# EAGLE board eclaire XL new (EAGLE 7.2.0), part 1 of 4
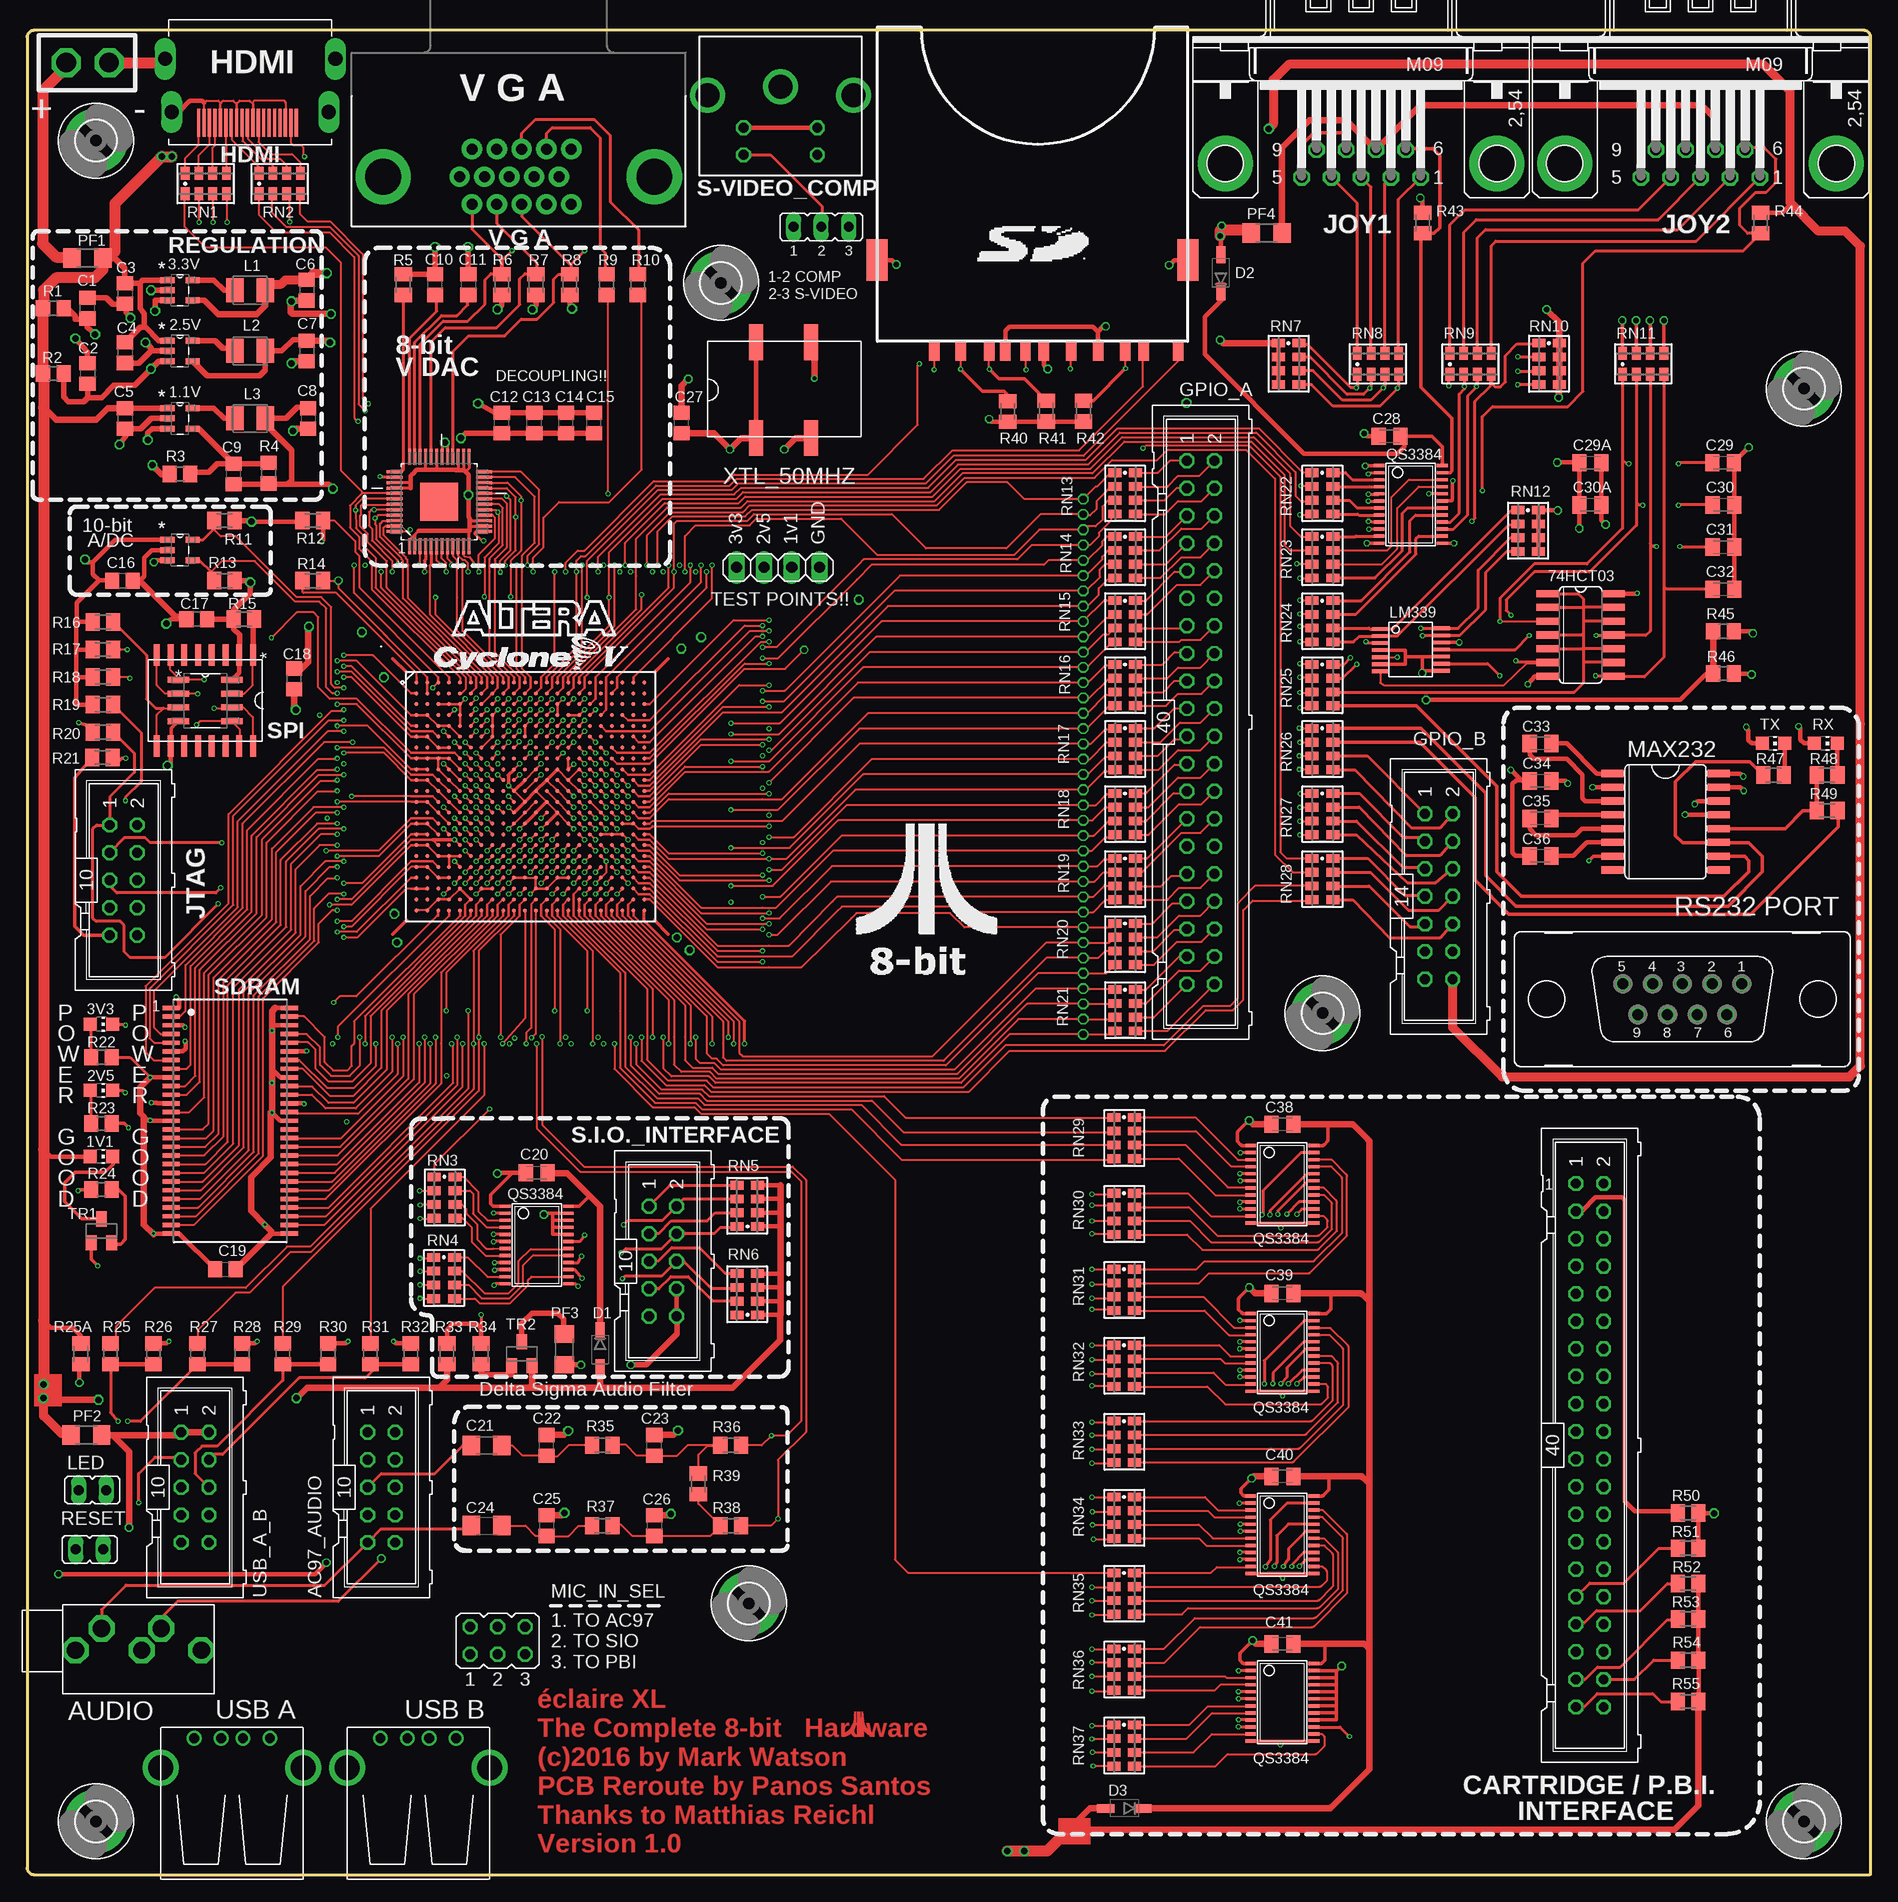
[diagram p17: board, top side]
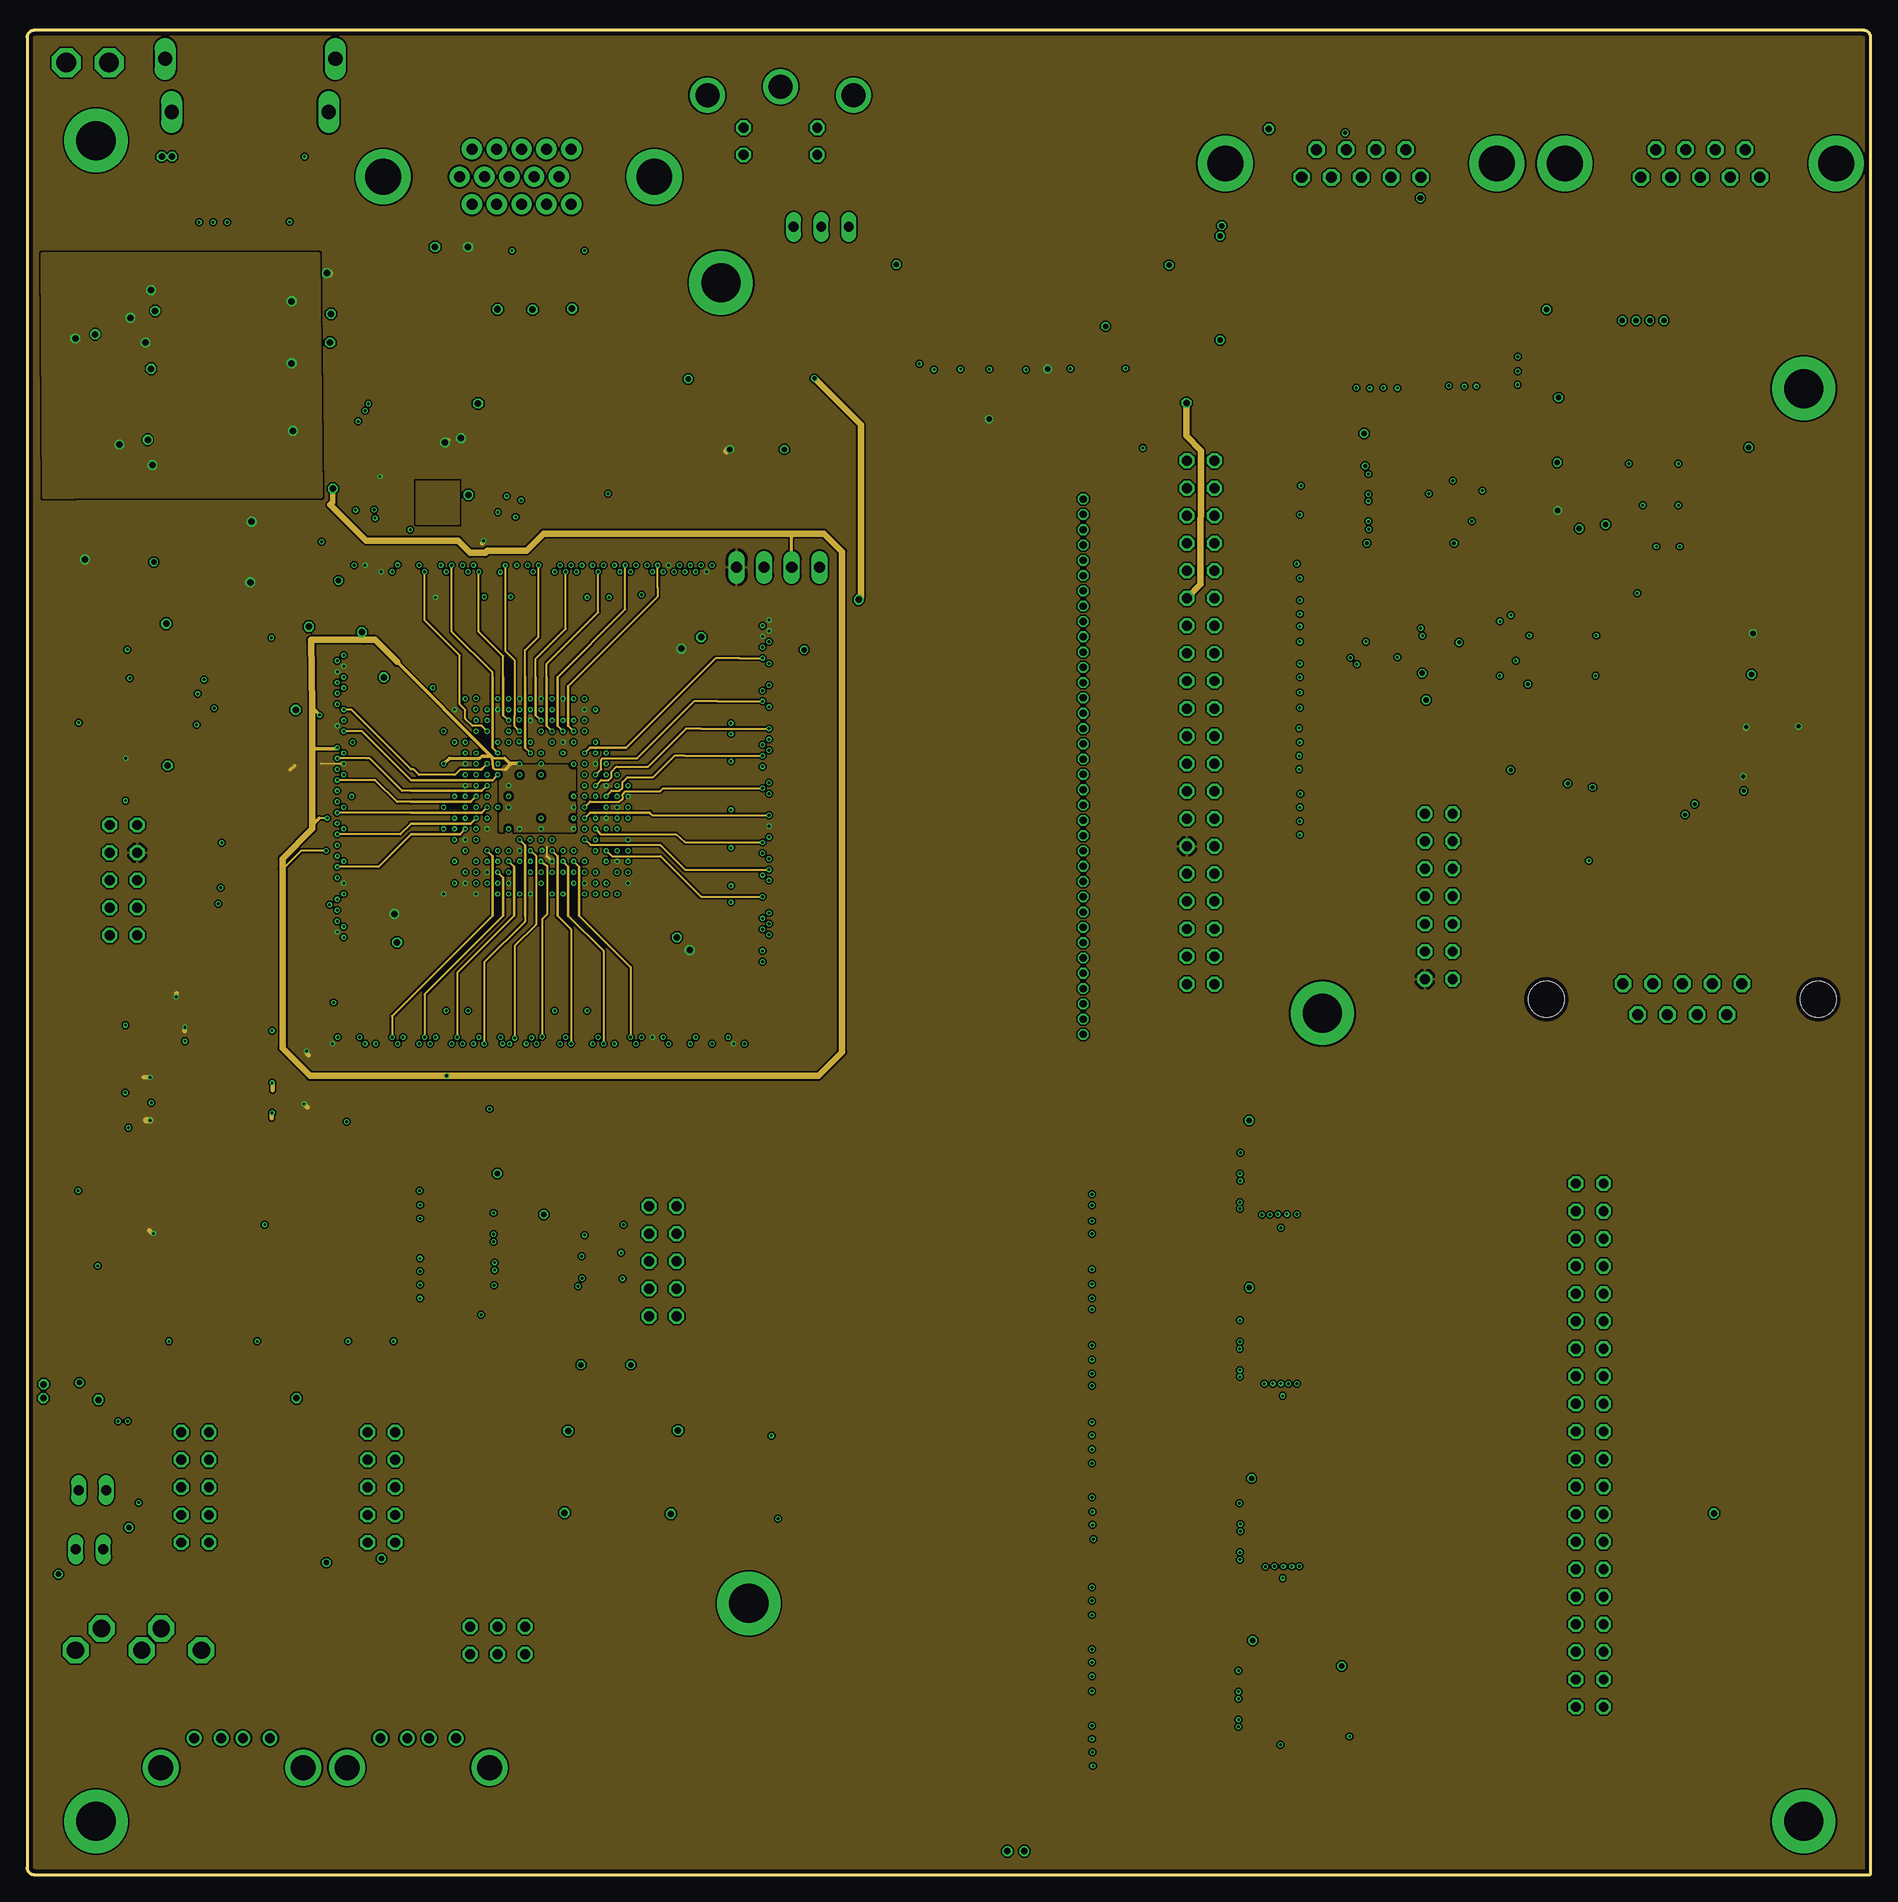
[diagram p18: board, inner layer Route2]
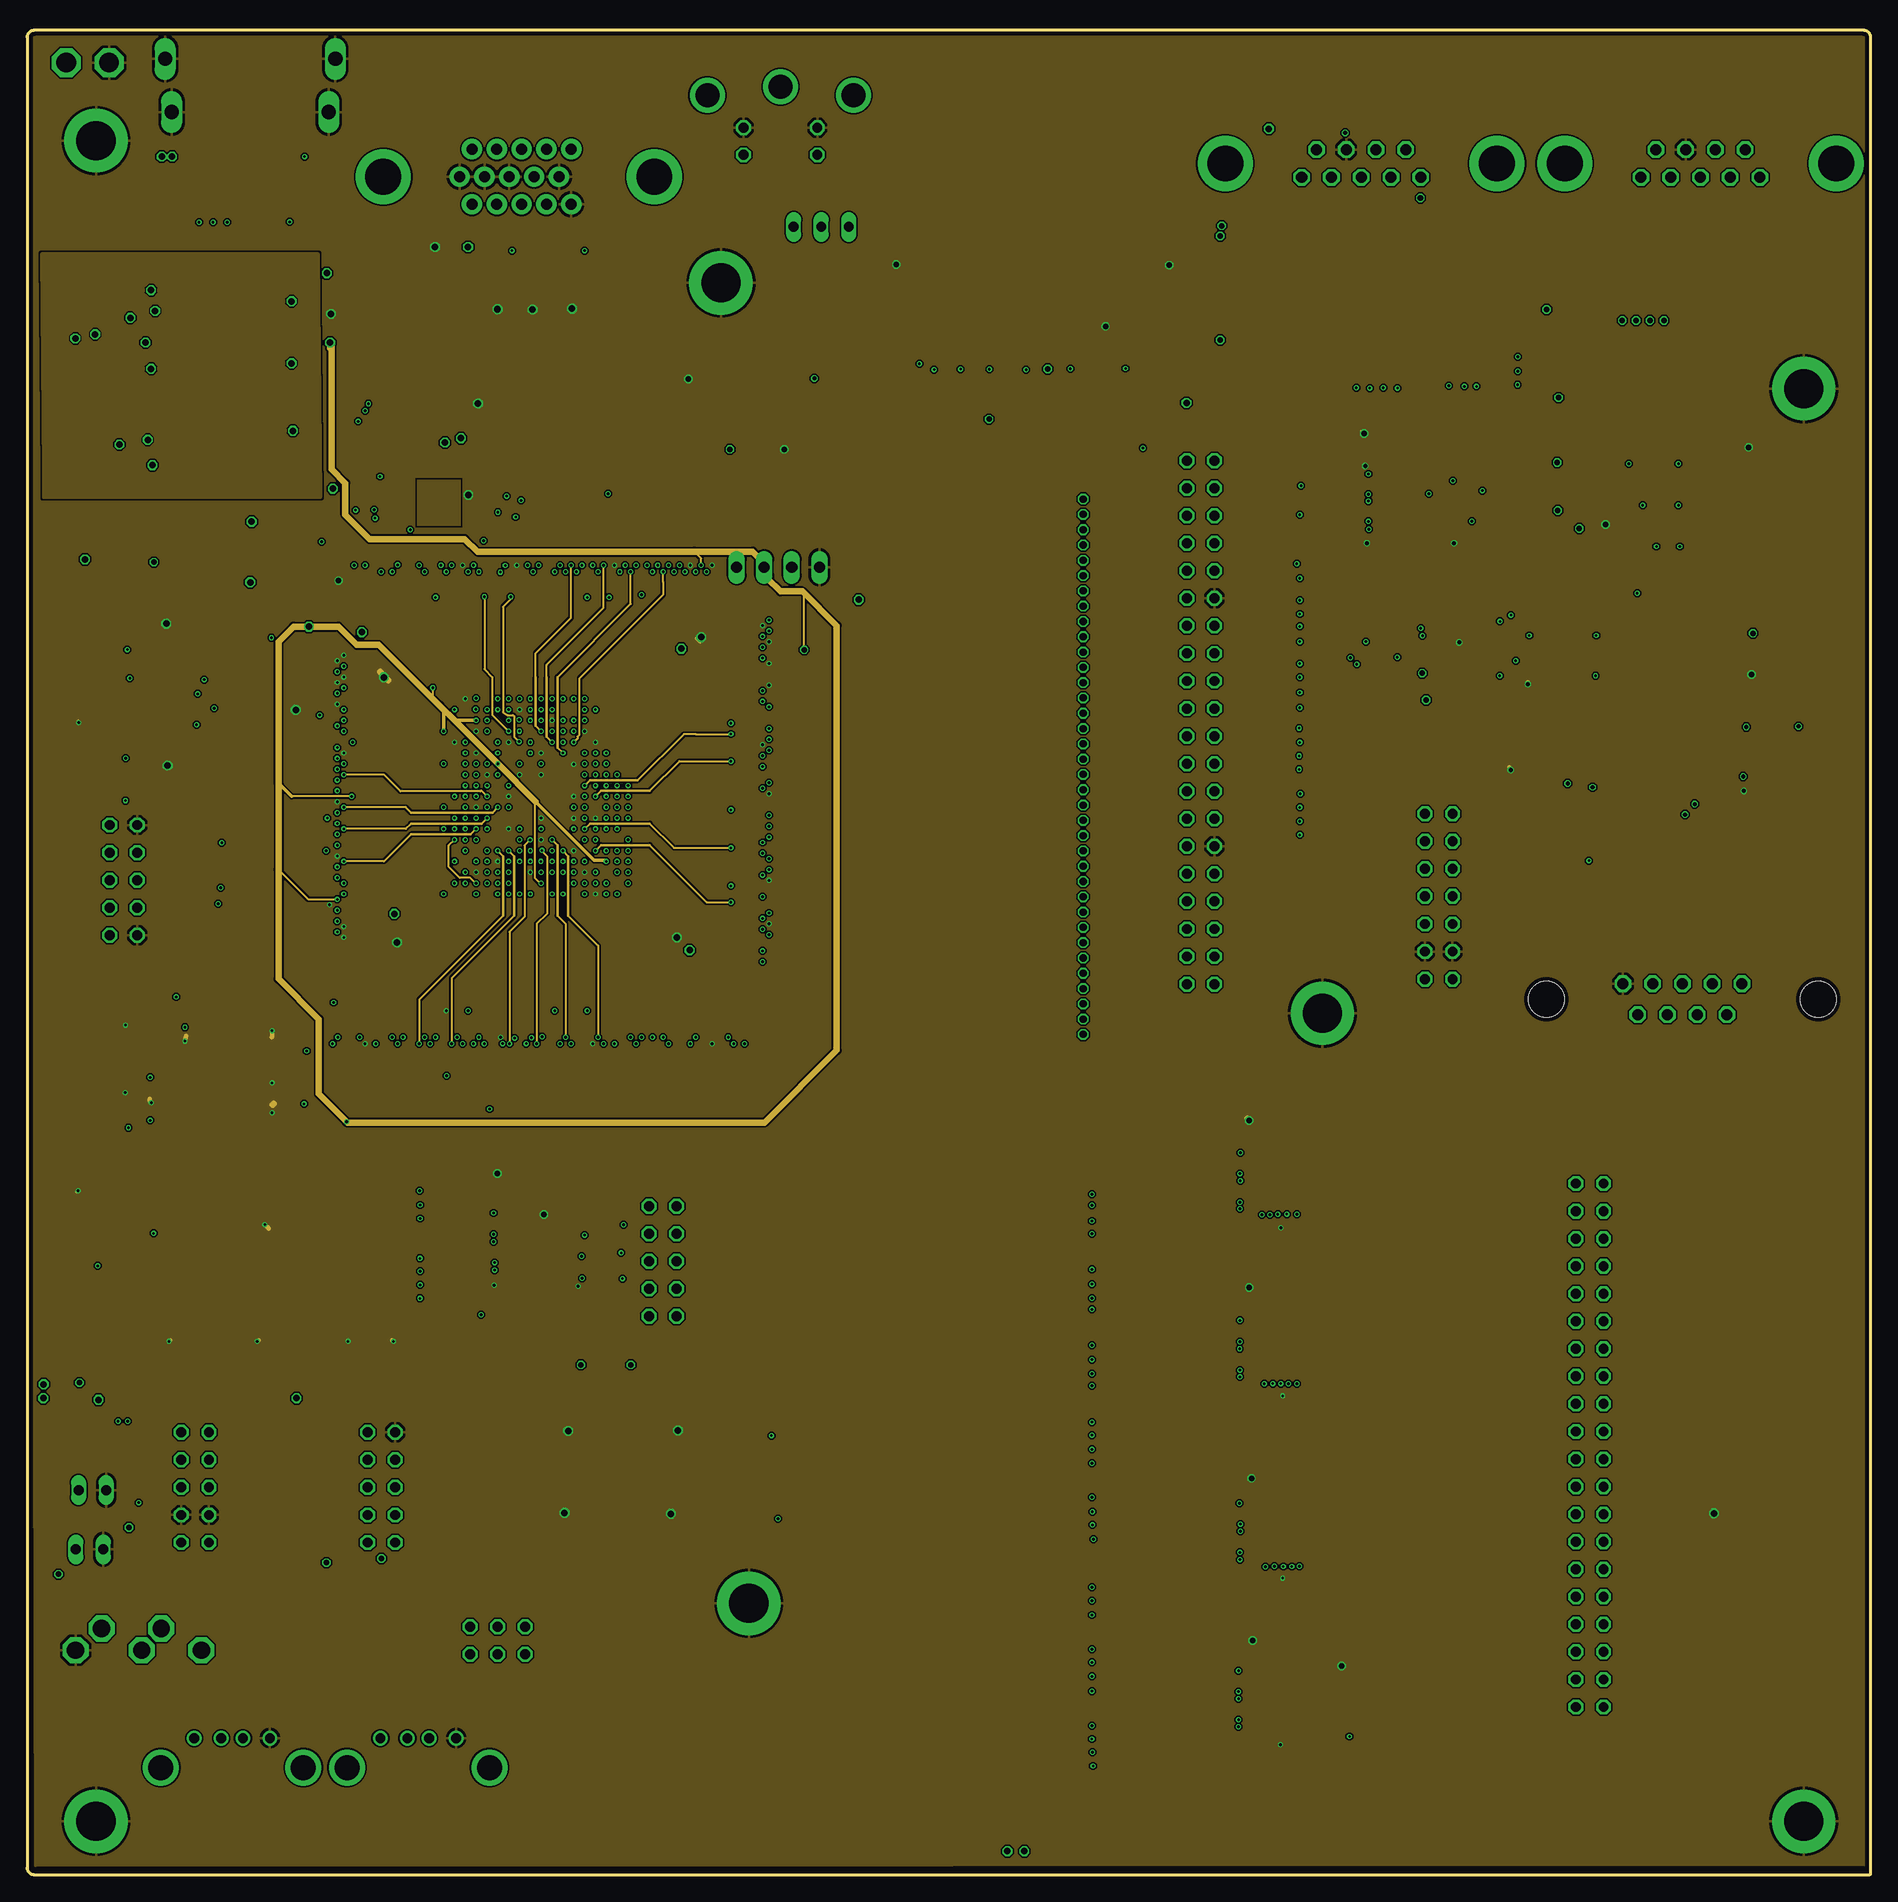
[diagram p19: board, inner layer Route15]
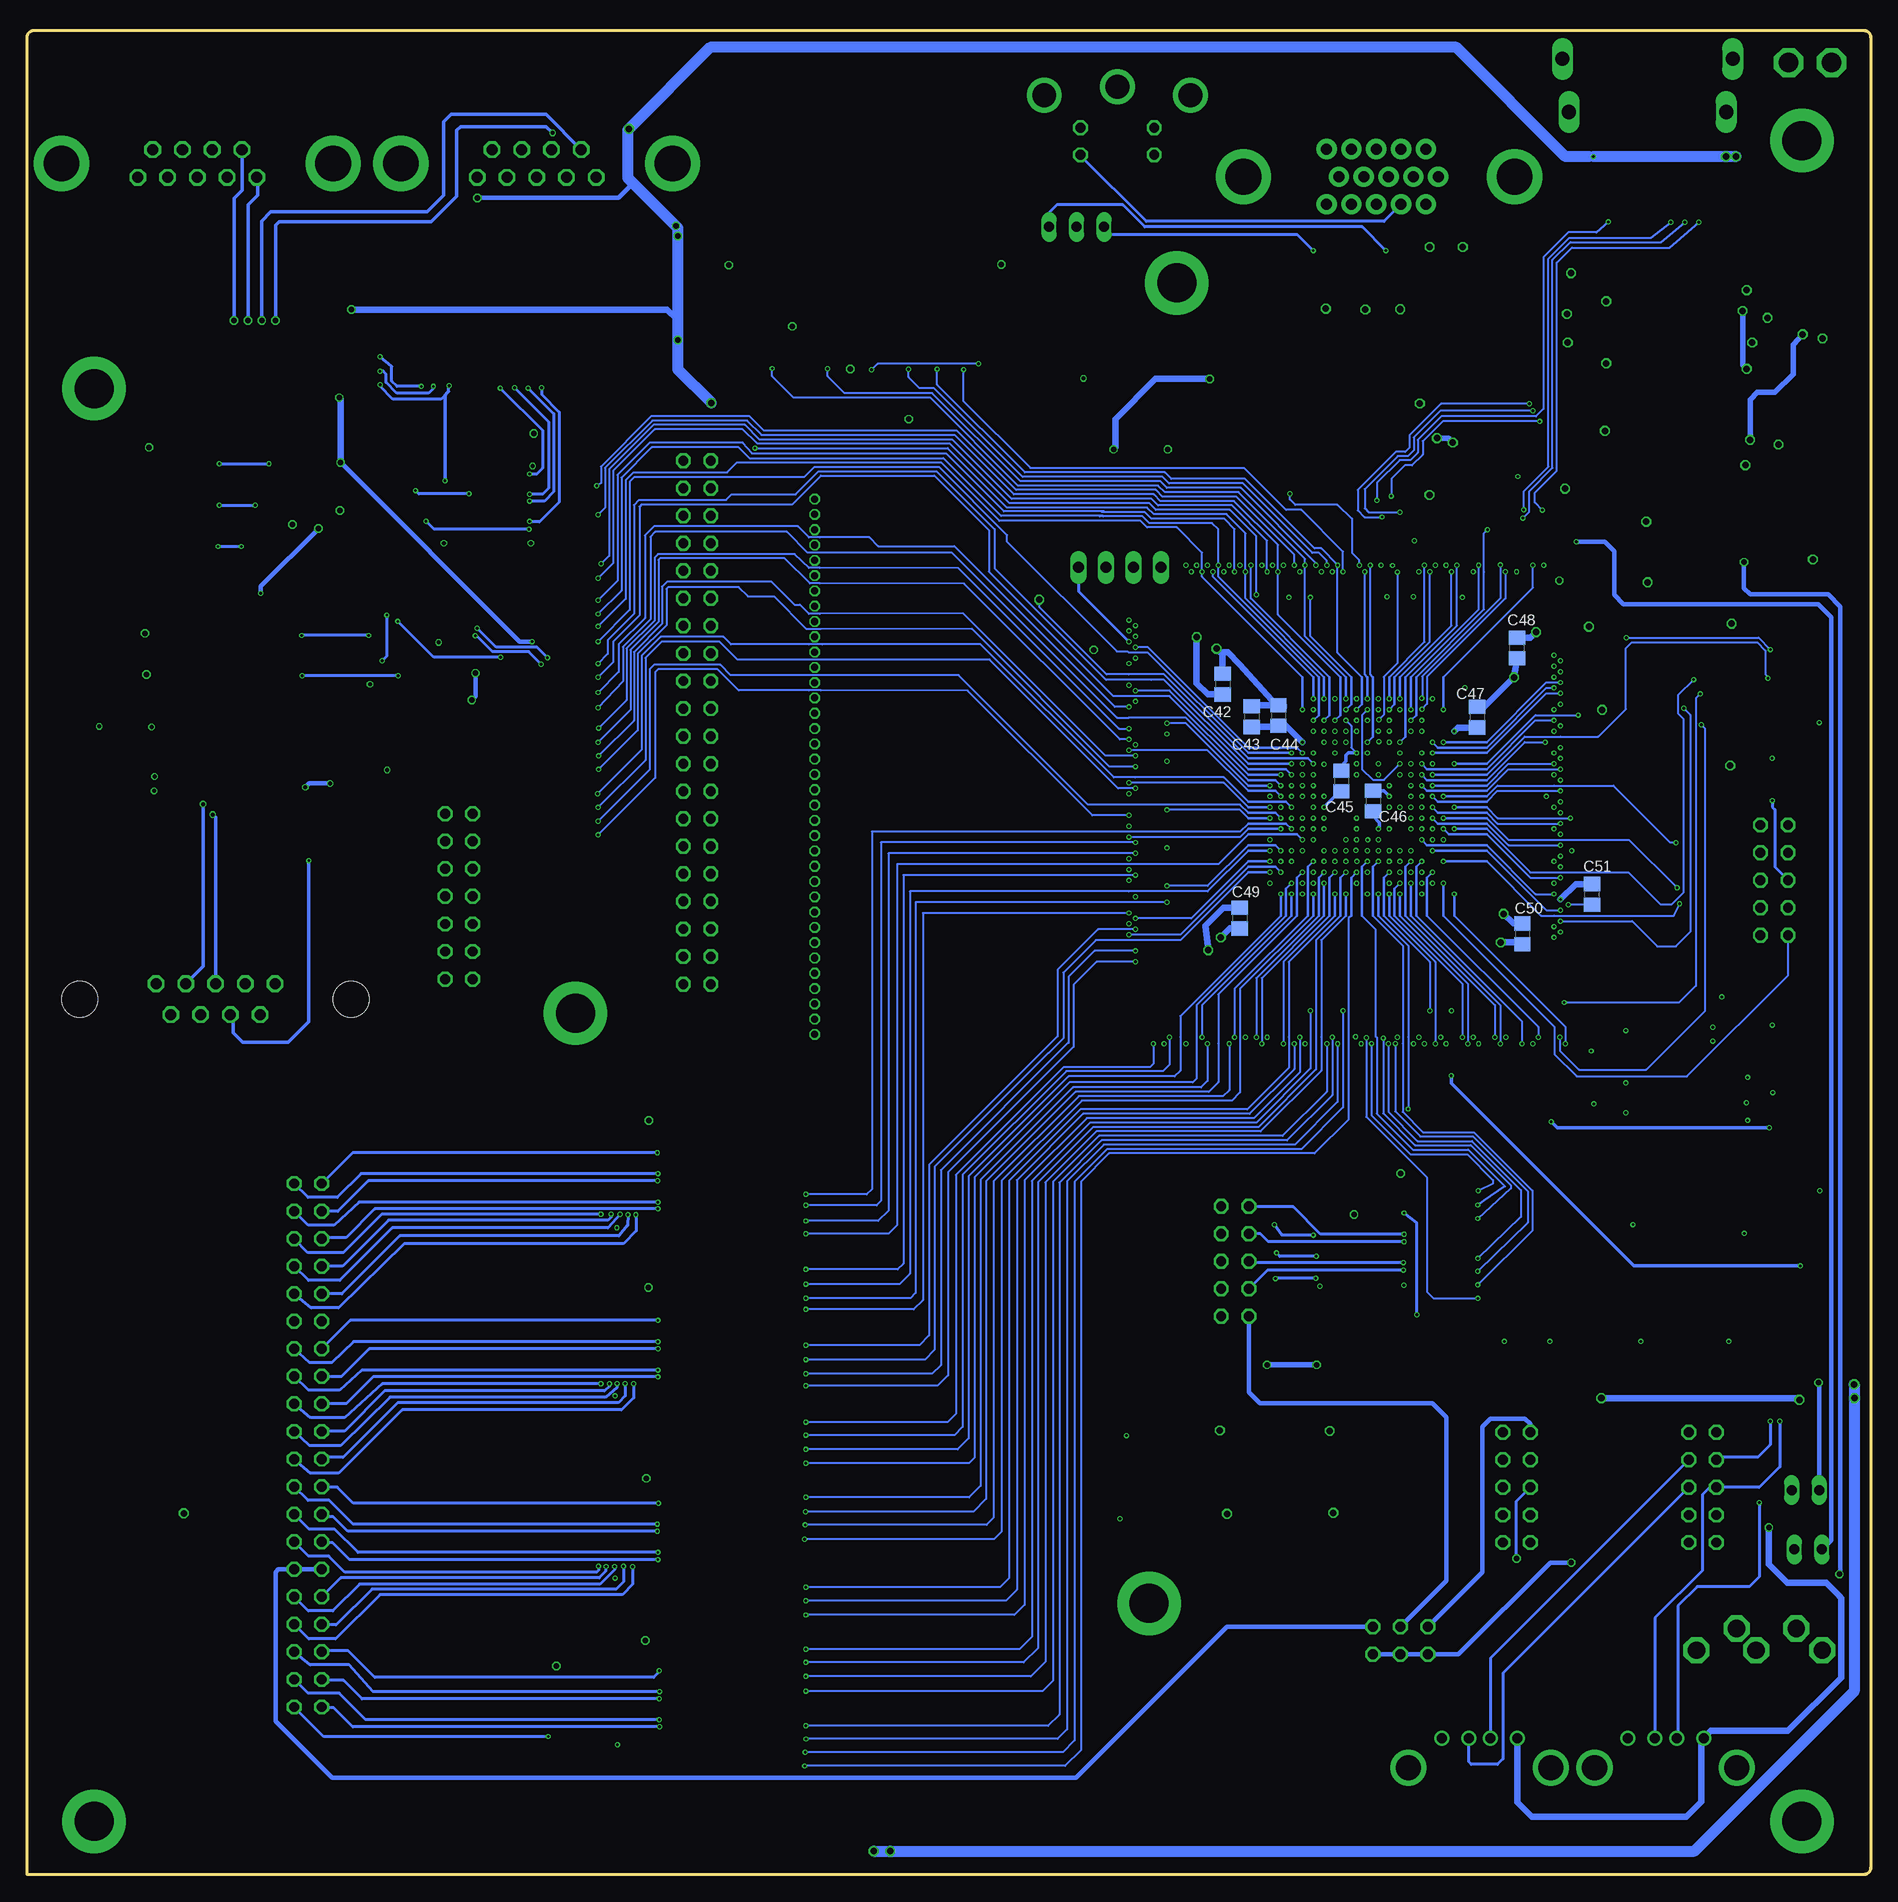
[diagram p20: board, bottom side, seen from below]

Size 170 x 170 mm. Coordinates in mm from the lower left corner, seen from the top.
Outline: 170,0 170,169.37 arc90 169.37,170 0.64,170 arc90 0,169.37 0,0.64 arc90 0.64,0 169.93,0
Copper layers (1*2*15*16): Top 0.035559375mm / dielectric 0.17018125mm / Route2 0.01778125mm / dielectric 47mil / Route15 0.01778125mm / dielectric 0.17018125mm / Bottom 0.035559375mm
Design rules "OSHPark-4layer *": minimum track width 5mil, minimum drill 10mil, track to track 5mil, track to pad 5mil, pad to pad 5mil, via to via 5mil, smd to smd 5mil, copper to edge 15mil, drill to drill 6mil, minimum pad ring 4mil, minimum via ring 4mil, stop-mask expansion 4mil, vias tented up to drill 10mil, thermal gap 10mil
Net classes: 3 N$8: width 0.508 mm

## Footprints (pad centres in the part's own frame; a part is rotated, then mirrored left to right if it is on the bottom)
SOT95P280X145-5N = smd 1.321 x 0.559: 1 -1.168,0.94; 2 -1.168,0; 3 -1.168,-0.94; 4 1.168,-0.94; 5 1.168,0.94
CHIP-LED0805 = smd 1.2 x 1.2: A 0,-1.05; C 0,1.05
1X04 = drill 1.016 long: 1 -3.81,0; 2 -1.27,0; 3 1.27,0; 4 3.81,0
SO14 = smd 0.66 x 2.032: 1 -3.81,-3.073; 2 -2.54,-3.073; 3 -1.27,-3.073; 4 0,-3.073; 5 1.27,-3.073; 6 2.54,-3.073; 7 3.81,-3.073; 8 3.81,3.073; 9 2.54,3.073; 10 1.27,3.073; 11 0,3.073; 12 -1.27,3.073; 13 -2.54,3.073; 14 -3.81,3.073
ML10 = drill 0.914 octagon: 1 -5.08,-1.27; 2 -5.08,1.27; 3 -2.54,-1.27; 4 -2.54,1.27; 5 0,-1.27; 6 0,1.27; 7 2.54,-1.27; 8 2.54,1.27; 9 5.08,-1.27; 10 5.08,1.27
C0805 = smd 1.3 x 1.5: 1 -0.95,0; 2 0.95,0
C0805K = smd 1.3 x 1.6: 1 -1,0; 2 1,0
C1206 = smd 1.6 x 1.8: 1 -1.4,0; 2 1.4,0
SOD123 = smd 1.6 x 0.8: 1 -1.7,0; 2 1.7,0
ML40 = drill 0.914 octagon: 1 -24.13,-1.27; 2 -24.13,1.27; 3 -21.59,-1.27; 4 -21.59,1.27; 5 -19.05,-1.27; 6 -19.05,1.27; 7 -16.51,-1.27; 8 -16.51,1.27; 9 -13.97,-1.27; 10 -13.97,1.27; 11 -11.43,-1.27; 12 -11.43,1.27; 13 -8.89,-1.27; 14 -8.89,1.27; 15 -6.35,-1.27; 16 -6.35,1.27; 17 -3.81,-1.27; 18 -3.81,1.27; 19 -1.27,-1.27; 20 -1.27,1.27; 21 1.27,-1.27; 22 1.27,1.27; 23 3.81,-1.27; 24 3.81,1.27; 25 6.35,-1.27; 26 6.35,1.27; 27 8.89,-1.27; 28 8.89,1.27; 29 11.43,-1.27; 30 11.43,1.27; 31 13.97,-1.27; 32 13.97,1.27; 33 16.51,-1.27; 34 16.51,1.27; 35 19.05,-1.27; 36 19.05,1.27; 37 21.59,-1.27; 38 21.59,1.27; 39 24.13,-1.27; 40 24.13,1.27
ML14 = drill 0.914 octagon: 1 -7.62,-1.27; 2 -7.62,1.27; 3 -5.08,-1.27; 4 -5.08,1.27; 5 -2.54,-1.27; 6 -2.54,1.27; 7 0,-1.27; 8 0,1.27; 9 2.54,-1.27; 10 2.54,1.27; 11 5.08,-1.27; 12 5.08,1.27; 13 7.62,-1.27; 14 7.62,1.27
3,6-PAD = drill 3.6 pad 5.842: B3,6 0,0
HDMI = smd 0.3 x 2.6: 1 4.75,4; 2 4.25,4; 3 3.75,4; 4 3.25,4; 5 2.75,4; 6 2.25,4; 7 1.75,4; 8 1.25,4; 9 0.75,4; 10 0.25,4; 11 -0.25,4; 12 -0.75,4; 13 -1.25,4; 14 -1.75,4; 15 -2.25,4; 16 -2.75,4; 17 -3.25,4; 18 -3.75,4; 19 -4.25,4 | drill 1.3 long: P$1 7.25,3; P$2 -7.25,3; P$3 -7.85,-1.9; P$4 7.85,-1.9
TSSOP24 = smd 0.305 x 0.991: 1 -3.575,-2.918; 2 -2.925,-2.918; 3 -2.275,-2.918; 4 -1.625,-2.918; 5 -0.975,-2.918; 6 -0.325,-2.918; 7 0.325,-2.918; 8 0.975,-2.918; 9 1.625,-2.918; 10 2.275,-2.918; 11 2.925,-2.918; 12 3.575,-2.918; 13 3.575,2.918; 14 2.925,2.918; 15 2.275,2.918; 16 1.625,2.918; 17 0.975,2.918; 18 0.325,2.918; 19 -0.325,2.918; 20 -0.975,2.918; 21 -1.625,2.918; 22 -2.275,2.918; 23 -2.925,2.918; 24 -3.575,2.918
AUDIO-JACK-CUI-353X = drill 1.6 pad 2.3 octagon: P$1 -1.9,4.6; P$2 0.1,2.2; P$3 0.1,-3.3; P$4 -1.9,-7 | drill 1.6 pad 2.4 octagon: P$5 -1.9,-1.5
M09HP = drill 1.016 octagon: 1 -5.486,1.27; 2 -2.743,1.27; 3 0,1.27; 4 2.743,1.27; 5 5.486,1.27; 6 -4.115,-1.27; 7 -1.372,-1.27; 8 1.372,-1.27; 9 4.115,-1.27 | drill 3.302 pad 5.08: G1 -12.522,0; G2 12.522,0
JP2 = drill 0.914 long: 1 -2.54,0; 2 0,0; 3 2.54,0
L3225M = smd 1.6 x 2.2: 1 -1.4,0; 2 1.4,0
TSSOP-14 = smd 1.6 x 0.35: 1 -2.8,1.9; 2 -2.8,1.25; 3 -2.8,0.6; 4 -2.8,-0.05; 5 -2.8,-0.7; 6 -2.8,-1.35; 7 -2.8,-2; 8 2.8,-1.95; 9 2.8,-1.3; 10 2.8,-0.65; 11 2.8,0; 12 2.8,0.65; 13 2.8,1.3; 14 2.8,1.95
SO16L = smd 0.66 x 2.032: 1 -4.445,-4.902; 2 -3.175,-4.902; 3 -1.905,-4.902; 4 -0.635,-4.902; 5 0.635,-4.902; 6 1.905,-4.902; 7 3.175,-4.902; 8 4.445,-4.902; 9 4.445,4.902; 10 3.175,4.902; 11 1.905,4.902; 12 0.635,4.902; 13 -0.635,4.902; 14 -1.905,4.902; 15 -3.175,4.902; 16 -4.445,4.902
JP3Q = drill 0.914 octagon: 1 -2.54,-1.27; 2 -2.54,1.27; 3 0,-1.27; 4 0,1.27; 5 2.54,-1.27; 6 2.54,1.27
R1206 = smd 1.6 x 1.803: 1 -1.422,0; 2 1.422,0
R0805 = smd 1.3 x 1.5: 1 -0.95,0; 2 0.95,0
M0805 = smd 1.3 x 1.6: 1 -0.95,0; 2 0.95,0
JP1 = drill 0.914 long: 1 0,-1.27; 2 0,1.27
743-8 = smd 0.8 x 1.2: 1 -1.905,-0.953; 2 -0.635,-0.953; 3 0.635,-0.953; 4 1.905,-0.953; 5 1.905,0.953; 6 0.635,0.953; 7 -0.635,0.953; 8 -1.905,0.953
MDIN04SS = drill 0.9 octagon: 1 3.4,8.5; 2 -3.4,8.5; 3 3.4,11; 4 -3.4,11 | drill 2.2: P$1 -6.74,5.5; P$2 0,4.71; P$3 6.74,5.5
SDSOCKET = smd 0.965 x 1.93: 1 7.7,-0.8; 2 10.3,-0.8; 3 11.8,-0.8; 3A 13.65,-0.8; 4 15.35,-0.8; 5 17.85,-0.8; 6 20.35,-0.8; 7 22.85,-0.8; 8 24.55,-0.8; 8A 27.75,-0.8; 9 5.25,-0.8 | smd 1.93 x 3.81: 10 -0.038,7.5; 11 28.638,7.5
TSOP54 = smd 0.4 x 1.6: 1 -10.4,-5.45; 2 -9.6,-5.45; 3 -8.8,-5.45; 4 -8,-5.45; 5 -7.2,-5.45; 6 -6.4,-5.45; 7 -5.6,-5.45; 8 -4.8,-5.45; 9 -4,-5.45; 10 -3.2,-5.45; 11 -2.4,-5.45; 12 -1.6,-5.45; 13 -0.8,-5.45; 14 0,-5.45; 15 0.8,-5.45; 16 1.6,-5.45; 17 2.4,-5.45; 18 3.2,-5.45; 19 4,-5.45; 20 4.8,-5.45; 21 5.6,-5.45; 22 6.4,-5.45; 23 7.2,-5.45; 24 8,-5.45; 25 8.8,-5.45; 26 9.6,-5.45; 27 10.4,-5.45; 28 10.4,5.45; 29 9.6,5.45; 30 8.8,5.45; 31 8,5.45; 32 7.2,5.45; 33 6.4,5.45; 34 5.6,5.45; 35 4.8,5.45; 36 4,5.45; 37 3.2,5.45; 38 2.4,5.45; 39 1.6,5.45; 40 0.8,5.45; 41 0,5.45; 42 -0.8,5.45; 43 -1.6,5.45; 44 -2.4,5.45; 45 -3.2,5.45; 46 -4,5.45; 47 -4.8,5.45; 48 -5.6,5.45; 49 -6.4,5.45; 50 -7.2,5.45; 51 -8,5.45; 52 -8.8,5.45; 53 -9.6,5.45; 54 -10.4,5.45
EPCS_BOTH = smd 1.981 x 0.559: 1 -2.464,1.905; 2 -2.464,0.635; 3 -2.464,-0.635; 4 -2.464,-1.905; 5 2.464,-1.905; 6 2.464,-0.635; 7 2.464,0.635; 8 2.464,1.905 | smd 0.559 x 1.981: L$1 4.41,4.21; L$2 3.14,4.21; L$3 1.87,4.21; L$4 0.6,4.21; L$5 -0.67,4.21; L$6 -1.94,4.21; L$7 -3.21,4.21; L$8 -4.48,4.21; L$9 -4.48,-4.21; L$10 -3.21,-4.21; L$11 -1.94,-4.21; L$12 -0.67,-4.21; L$13 0.6,-4.21; L$14 1.87,-4.21; L$15 3.14,-4.21; L$16 4.41,-4.21
SOT23-BEC = smd 1 x 1.4: B -0.95,-1.1; C 0,1.1; E 0.95,-1.1
CYCLONEVF484V2 = smd 0.38 x 0.38: A1 -10.5,10.5; A2 -9.5,10.5; A3 -8.5,10.5; A4 -7.5,10.5; A5 -6.5,10.5; A6 -5.5,10.5; A7 -4.5,10.5; A8 -3.5,10.5; A9 -2.5,10.5; A10 -1.5,10.5; A11 -0.5,10.5; A12 0.5,10.5; A13 1.5,10.5; A14 2.5,10.5; A15 3.5,10.5; A16 4.5,10.5; A17 5.5,10.5; A18 6.5,10.5; A19 7.5,10.5; A20 8.5,10.5; A21 9.5,10.5; A22 10.5,10.5; AA1 -10.5,-9.5; AA2 -9.5,-9.5; AA3 -8.5,-9.5; AA4 -7.5,-9.5; AA5 -6.5,-9.5; AA6 -5.5,-9.5; AA7 -4.5,-9.5; AA8 -3.5,-9.5; AA9 -2.5,-9.5; AA10 -1.5,-9.5; AA11 -0.5,-9.5; AA12 0.5,-9.5; AA13 1.5,-9.5; AA14 2.5,-9.5; AA15 3.5,-9.5; AA16 4.5,-9.5; AA17 5.5,-9.5; AA18 6.5,-9.5; AA19 7.5,-9.5; AA20 8.5,-9.5; AA21 9.5,-9.5; AA22 10.5,-9.5; AB1 -10.5,-10.5; AB2 -9.5,-10.5; AB3 -8.5,-10.5; AB4 -7.5,-10.5; AB5 -6.5,-10.5; AB6 -5.5,-10.5; AB7 -4.5,-10.5; AB8 -3.5,-10.5; AB9 -2.5,-10.5; AB10 -1.5,-10.5; AB11 -0.5,-10.5; AB12 0.5,-10.5; AB13 1.5,-10.5; AB14 2.5,-10.5; AB15 3.5,-10.5; AB16 4.5,-10.5; AB17 5.5,-10.5; AB18 6.5,-10.5; AB19 7.5,-10.5; AB20 8.5,-10.5; AB21 9.5,-10.5; AB22 10.5,-10.5; B1 -10.5,9.5; B2 -9.5,9.5; B3 -8.5,9.5; B4 -7.5,9.5; B5 -6.5,9.5; B6 -5.5,9.5; B7 -4.5,9.5; B8 -3.5,9.5; B9 -2.5,9.5; B10 -1.5,9.5; B11 -0.5,9.5; B12 0.5,9.5; B13 1.5,9.5; B14 2.5,9.5; B15 3.5,9.5; B16 4.5,9.5; B17 5.5,9.5; B18 6.5,9.5; B19 7.5,9.5; B20 8.5,9.5; B21 9.5,9.5; B22 10.5,9.5; C1 -10.5,8.5; C2 -9.5,8.5; C3 -8.5,8.5; C4 -7.5,8.5; C5 -6.5,8.5; C6 -5.5,8.5; C7 -4.5,8.5; C8 -3.5,8.5; C9 -2.5,8.5; C10 -1.5,8.5; C11 -0.5,8.5; C12 0.5,8.5; C13 1.5,8.5; C14 2.5,8.5; C15 3.5,8.5; C16 4.5,8.5; C17 5.5,8.5; C18 6.5,8.5; C19 7.5,8.5; C20 8.5,8.5; C21 9.5,8.5; C22 10.5,8.5; D1 -10.5,7.5; D2 -9.5,7.5; D3 -8.5,7.5; D4 -7.5,7.5; D5 -6.5,7.5; D6 -5.5,7.5; D7 -4.5,7.5; D8 -3.5,7.5; D9 -2.5,7.5; D10 -1.5,7.5; D11 -0.5,7.5; D12 0.5,7.5; D13 1.5,7.5; D14 2.5,7.5; D15 3.5,7.5; D16 4.5,7.5; D17 5.5,7.5; D18 6.5,7.5; D19 7.5,7.5; D20 8.5,7.5; D21 9.5,7.5; D22 10.5,7.5; E1 -10.5,6.5; E2 -9.5,6.5; E3 -8.5,6.5; E4 -7.5,6.5; E5 -6.5,6.5; E6 -5.5,6.5; E7 -4.5,6.5; E8 -3.5,6.5; E9 -2.5,6.5; E10 -1.5,6.5; E11 -0.5,6.5; E12 0.5,6.5; E13 1.5,6.5; E14 2.5,6.5; E15 3.5,6.5; E16 4.5,6.5; E17 5.5,6.5; E18 6.5,6.5; E19 7.5,6.5; E20 8.5,6.5; E21 9.5,6.5; E22 10.5,6.5; F1 -10.5,5.5; F2 -9.5,5.5; F3 -8.5,5.5; F4 -7.5,5.5; F5 -6.5,5.5; F6 -5.5,5.5; F7 -4.5,5.5; F8 -3.5,5.5; F9 -2.5,5.5; F10 -1.5,5.5; F11 -0.5,5.5; F12 0.5,5.5; F13 1.5,5.5; F14 2.5,5.5; F15 3.5,5.5; F16 4.5,5.5; F17 5.5,5.5; F18 6.5,5.5; F19 7.5,5.5; F20 8.5,5.5; F21 9.5,5.5; F22 10.5,5.5; G1 -10.5,4.5; G2 -9.5,4.5; G3 -8.5,4.5; G4 -7.5,4.5; G5 -6.5,4.5; G6 -5.5,4.5; G7 -4.5,4.5; G8 -3.5,4.5; G9 -2.5,4.5; G10 -1.5,4.5; G11 -0.5,4.5; G12 0.5,4.5; G13 1.5,4.5; G14 2.5,4.5; G15 3.5,4.5; G16 4.5,4.5; G17 5.5,4.5; G18 6.5,4.5; G19 7.5,4.5; G20 8.5,4.5; G21 9.5,4.5; G22 10.5,4.5; H1 -10.5,3.5; H2 -9.5,3.5; H3 -8.5,3.5; H4 -7.5,3.5; H5 -6.5,3.5; H6 -5.5,3.5; H7 -4.5,3.5; H8 -3.5,3.5; H9 -2.5,3.5; H10 -1.5,3.5; H11 -0.5,3.5; H12 0.5,3.5; H13 1.5,3.5; H14 2.5,3.5; H15 3.5,3.5; H16 4.5,3.5; H17 5.5,3.5; H18 6.5,3.5; H19 7.5,3.5; H20 8.5,3.5; H21 9.5,3.5; H22 10.5,3.5; J1 -10.5,2.5; J2 -9.5,2.5; J3 -8.5,2.5; J4 -7.5,2.5; J5 -6.5,2.5; J6 -5.5,2.5; J7 -4.5,2.5; J8 -3.5,2.5; J9 -2.5,2.5; J10 -1.5,2.5; J11 -0.5,2.5; J12 0.5,2.5; J13 1.5,2.5; J14 2.5,2.5; J15 3.5,2.5; J16 4.5,2.5; J17 5.5,2.5; J18 6.5,2.5; J19 7.5,2.5; J20 8.5,2.5; J21 9.5,2.5; J22 10.5,2.5; K1 -10.5,1.5; K2 -9.5,1.5; K3 -8.5,1.5; K4 -7.5,1.5; K5 -6.5,1.5; K6 -5.5,1.5; K7 -4.5,1.5; K8 -3.5,1.5; K9 -2.5,1.5; K10 -1.5,1.5; K11 -0.5,1.5; K12 0.5,1.5; K13 1.5,1.5; K14 2.5,1.5; K15 3.5,1.5; K16 4.5,1.5; K17 5.5,1.5; K18 6.5,1.5; K19 7.5,1.5; K20 8.5,1.5; K21 9.5,1.5; K22 10.5,1.5; L1 -10.5,0.5; L2 -9.5,0.5; L3 -8.5,0.5; L4 -7.5,0.5; L5 -6.5,0.5; L6 -5.5,0.5; L7 -4.5,0.5; L8 -3.5,0.5; L9 -2.5,0.5; L10 -1.5,0.5; L11 -0.5,0.5; L12 0.5,0.5; L13 1.5,0.5; L14 2.5,0.5; L15 3.5,0.5; L16 4.5,0.5; L17 5.5,0.5; L18 6.5,0.5; L19 7.5,0.5; L20 8.5,0.5; L21 9.5,0.5; L22 10.5,0.5; M1 -10.5,-0.5; M2 -9.5,-0.5; M3 -8.5,-0.5; M4 -7.5,-0.5; M5 -6.5,-0.5; M6 -5.5,-0.5; M7 -4.5,-0.5; M8 -3.5,-0.5; M9 -2.5,-0.5; M10 -1.5,-0.5; M11 -0.5,-0.5; M12 0.5,-0.5; M13 1.5,-0.5; M14 2.5,-0.5; M15 3.5,-0.5; M16 4.5,-0.5; M17 5.5,-0.5; M18 6.5,-0.5; M19 7.5,-0.5; M20 8.5,-0.5; M21 9.5,-0.5; M22 10.5,-0.5; N1 -10.5,-1.5; N2 -9.5,-1.5; N3 -8.5,-1.5; N4 -7.5,-1.5; N5 -6.5,-1.5; N6 -5.5,-1.5; N7 -4.5,-1.5; N8 -3.5,-1.5; N9 -2.5,-1.5; N10 -1.5,-1.5; N11 -0.5,-1.5; N12 0.5,-1.5; N13 1.5,-1.5; N14 2.5,-1.5; N15 3.5,-1.5; N16 4.5,-1.5; N17 5.5,-1.5; N18 6.5,-1.5; N19 7.5,-1.5; N20 8.5,-1.5; N21 9.5,-1.5; N22 10.5,-1.5; P1 -10.5,-2.5; P2 -9.5,-2.5; P3 -8.5,-2.5; P4 -7.5,-2.5; P5 -6.5,-2.5; P6 -5.5,-2.5; P7 -4.5,-2.5; P8 -3.5,-2.5; P9 -2.5,-2.5; P10 -1.5,-2.5; P11 -0.5,-2.5; P12 0.5,-2.5; P13 1.5,-2.5; P14 2.5,-2.5; P15 3.5,-2.5; P16 4.5,-2.5; P17 5.5,-2.5; P18 6.5,-2.5; P19 7.5,-2.5; P20 8.5,-2.5; P21 9.5,-2.5; P22 10.5,-2.5; R1 -10.5,-3.5; R2 -9.5,-3.5; R3 -8.5,-3.5; R4 -7.5,-3.5; R5 -6.5,-3.5; R6 -5.5,-3.5; R7 -4.5,-3.5; R8 -3.5,-3.5; R9 -2.5,-3.5; R10 -1.5,-3.5; R11 -0.5,-3.5; R12 0.5,-3.5; R13 1.5,-3.5; R14 2.5,-3.5; R15 3.5,-3.5; R16 4.5,-3.5; R17 5.5,-3.5; R18 6.5,-3.5; R19 7.5,-3.5; R20 8.5,-3.5; R21 9.5,-3.5; R22 10.5,-3.5; T1 -10.5,-4.5; T2 -9.5,-4.5; T3 -8.5,-4.5; T4 -7.5,-4.5; T5 -6.5,-4.5; T6 -5.5,-4.5; T7 -4.5,-4.5; T8 -3.5,-4.5; T9 -2.5,-4.5; T10 -1.5,-4.5; T11 -0.5,-4.5; T12 0.5,-4.5; T13 1.5,-4.5; T14 2.5,-4.5; T15 3.5,-4.5; T16 4.5,-4.5; T17 5.5,-4.5; T18 6.5,-4.5; T19 7.5,-4.5; T20 8.5,-4.5; T21 9.5,-4.5; T22 10.5,-4.5; U1 -10.5,-5.5; U2 -9.5,-5.5; U3 -8.5,-5.5; U4 -7.5,-5.5; U5 -6.5,-5.5; U6 -5.5,-5.5; U7 -4.5,-5.5; U8 -3.5,-5.5; U9 -2.5,-5.5; U10 -1.5,-5.5; U11 -0.5,-5.5; U12 0.5,-5.5; U13 1.5,-5.5; U14 2.5,-5.5; U15 3.5,-5.5; U16 4.5,-5.5; U17 5.5,-5.5; U18 6.5,-5.5; U19 7.5,-5.5; U20 8.5,-5.5; U21 9.5,-5.5; U22 10.5,-5.5; V1 -10.5,-6.5; V2 -9.5,-6.5; V3 -8.5,-6.5; V4 -7.5,-6.5; V5 -6.5,-6.5; V6 -5.5,-6.5; V7 -4.5,-6.5; V8 -3.5,-6.5; V9 -2.5,-6.5; V10 -1.5,-6.5; V11 -0.5,-6.5; V12 0.5,-6.5; V13 1.5,-6.5; V14 2.5,-6.5; V15 3.5,-6.5; V16 4.5,-6.5; V17 5.5,-6.5; V18 6.5,-6.5; V19 7.5,-6.5; V20 8.5,-6.5; V21 9.5,-6.5; V22 10.5,-6.5; W1 -10.5,-7.5; W2 -9.5,-7.5; W3 -8.5,-7.5; W4 -7.5,-7.5; W5 -6.5,-7.5; W6 -5.5,-7.5; W7 -4.5,-7.5; W8 -3.5,-7.5; W9 -2.5,-7.5; W10 -1.5,-7.5; W11 -0.5,-7.5; W12 0.5,-7.5; W13 1.5,-7.5; W14 2.5,-7.5; W15 3.5,-7.5; W16 4.5,-7.5; W17 5.5,-7.5; W18 6.5,-7.5; W19 7.5,-7.5; W20 8.5,-7.5; W21 9.5,-7.5; W22 10.5,-7.5; Y1 -10.5,-8.5; Y2 -9.5,-8.5; Y3 -8.5,-8.5; Y4 -7.5,-8.5; Y5 -6.5,-8.5; Y6 -5.5,-8.5; Y7 -4.5,-8.5; Y8 -3.5,-8.5; Y9 -2.5,-8.5; Y10 -1.5,-8.5; Y11 -0.5,-8.5; Y12 0.5,-8.5; Y13 1.5,-8.5; Y14 2.5,-8.5; Y15 3.5,-8.5; Y16 4.5,-8.5; Y17 5.5,-8.5; Y18 6.5,-8.5; Y19 7.5,-8.5; Y20 8.5,-8.5; Y21 9.5,-8.5; Y22 10.5,-8.5
HDR_141_36 = drill 0.65 octagon: P$1 -25.38,0; P$2 -23.97,0; P$3 -22.56,0; P$4 -21.15,0; P$5 -19.74,0; P$6 -18.33,0; P$7 -16.92,0; P$8 -15.51,0; P$9 -14.1,0; P$10 -12.69,0; P$11 -11.28,0; P$12 -9.87,0; P$13 -8.46,0; P$14 -7.05,0; P$15 -5.64,0; P$16 -4.23,0; P$17 -2.82,0; P$18 -1.41,0; P$19 0,0; P$20 1.41,0; P$21 2.82,0; P$22 4.23,0; P$23 5.64,0; P$24 7.05,0; P$25 8.46,0; P$26 9.87,0; P$27 11.28,0; P$28 12.69,0; P$29 14.1,0; P$30 15.51,0; P$31 16.92,0; P$32 18.33,0; P$33 19.74,0; P$34 21.15,0; P$35 22.56,0; P$36 23.97,0
MOLEX_PS = drill 1.8 octagon: + 0,0; - 3.96,0
DB15 = drill 1.016 pad 1.88: 1 -4.32,-7.62; 2 -2.03,-7.62; 3 0.26,-7.62; 4 2.55,-7.62; 5 4.84,-7.62; 6 -5.46,-5.08; 7 -3.17,-5.08; 8 -0.88,-5.08; 9 1.41,-5.08; 10 3.7,-5.08; 11 -4.32,-2.54; 12 -2.03,-2.54; 13 0.26,-2.54; 14 2.55,-2.54; 15 4.84,-2.54 | drill 3.302 pad 5.08: G1 -12.5,-5.08; G2 12.5,-5.08
QFP50P900X900X120-49N = smd 1.473 x 0.279: 1 -4.115,2.743; 2 -4.115,2.261; 3 -4.115,1.753; 4 -4.115,1.245; 5 -4.115,0.762; 6 -4.115,0.254; 7 -4.115,-0.254; 8 -4.115,-0.762; 9 -4.115,-1.245; 10 -4.115,-1.753; 11 -4.115,-2.261; 12 -4.115,-2.743; 25 4.115,-2.743; 26 4.115,-2.261; 27 4.115,-1.753; 28 4.115,-1.245; 29 4.115,-0.762; 30 4.115,-0.254; 31 4.115,0.254; 32 4.115,0.762; 33 4.115,1.245; 34 4.115,1.753; 35 4.115,2.261; 36 4.115,2.743 | smd 0.279 x 1.473: 13 -2.743,-4.115; 14 -2.261,-4.115; 15 -1.753,-4.115; 16 -1.245,-4.115; 17 -0.762,-4.115; 18 -0.254,-4.115; 19 0.254,-4.115; 20 0.762,-4.115; 21 1.245,-4.115; 22 1.753,-4.115; 23 2.261,-4.115; 24 2.743,-4.115; 37 2.743,4.115; 38 2.261,4.115; 39 1.753,4.115; 40 1.245,4.115; 41 0.762,4.115; 42 0.254,4.115; 43 -0.254,4.115; 44 -0.762,4.115; 45 -1.245,4.115; 46 -1.753,4.115; 47 -2.261,4.115; 48 -2.743,4.115 | smd 3.505 x 3.505: 49 0,0
USB-A-H = drill 0.914: D+ 2.718,-1.003; D- 2.718,1.003; GND 2.718,-3.493; VBUS 2.718,3.493 | drill 2.311: P$5 0,-6.566; P$6 0,6.566
F09V = drill 1.016 octagon: 1 5.486,1.422; 2 2.743,1.422; 3 0,1.422; 4 -2.743,1.422; 5 -5.486,1.422; 6 4.115,-1.422; 7 1.372,-1.422; 8 -1.372,-1.422; 9 -4.115,-1.422 | hole 3.302: -12.522,0; 12.522,0
SG-636 = smd 1.3 x 3.3: P$1 -2.54,-5.03; P$2 2.54,-5.03; P$3 2.54,3.8; P$4 -2.54,3.8

## Placement (x,y rotation side)
1.1V  U3  [SOT95P280X145-5N]  14.1,134.24 0 top
1V1  White  [CHIP-LED0805]  6.86,66.19 270 top
2.5V  U2  [SOT95P280X145-5N]  14.1,140.46 0 top
2V5  Green  [CHIP-LED0805]  6.86,72.29 270 top
3.3/2.5/1.1/GND  J2  [1X04]  69.24,120.5 0 top
3.3V  U1  [SOT95P280X145-5N]  14.1,146.05 0 top
3V3  Red  [CHIP-LED0805]  6.86,78.38 270 top
74HCT03  U12  [SO14]  143.26,114.27 270 top
AC97_AUDIO  [ML10]  32.66,35.69 270 top
ADC  U4  [SOT95P280X145-5N]  14.1,122.1 0 top
C1  10uF  [C0805]  5.56,144.4 90 top
C2  10uF  [C0805]  5.56,138.38 270 top
C3  10uF  [C0805]  9.02,145.76 270 top
C4  10uF  [C0805]  9.02,140.29 270 top
C5  10uF  [C0805]  9.02,134.24 270 top
C6  22uF  [C0805]  25.78,146.05 270 top
C7  22uF  [C0805]  25.78,140.46 270 top
C8  22uF  [C0805]  25.91,134.24 270 top
C9  15pF  [C0805]  19.05,129.11 90 top
C10  0.1uF  [C0805]  37.63,146.56 90 top
C11  0.1uF  [C0805]  40.68,146.56 270 top
C12  0.1uF  [C0805]  43.77,133.81 90 top
C13  0.01uF  [C0805]  46.77,133.81 90 top
C14  0.1uF  [C0805]  49.7,133.81 90 top
C15  10uF  [C0805]  52.28,133.81 90 top
C16  0.1uF  [C0805]  8.79,119.28 0 top
C17  0.1uF  [C0805]  15.65,115.72 180 top
C18  2.2uF  [C0805]  24.63,110.23 90 top
C19  0.1uF  [C0805]  18.28,55.8 0 top
C20  0.1uF  [C0805K]  46.99,64.69 180 top
C21  100uF  [C1206]  42.37,39.57 0 top
C22  10nF  [C0805]  47.9,39.57 90 top
C23  10nF  [C0805]  57.84,39.57 90 top
C24  100uF  [C1206]  42.37,32.16 0 top
C25  10nF  [C0805]  47.9,32.16 270 top
C26  10nF  [C0805]  57.84,32.16 270 top
C27  0.1uF  [C0805]  60.36,133.81 90 top
C28  0.1uF  [C0805K]  125.63,132.59 0 top
C29  0.047uF  [C0805K]  156.39,130.15 0 top
C29A  0.1uF  [C0805K]  144.15,130.15 0 top
C30  0.047uF  [C0805K]  156.41,126.26 0 top
C30A  0.1uF  [C0805K]  144.15,126.26 0 top
C31  0.047uF  [C0805K]  156.41,122.38 0 top
C32  0.047uF  [C0805K]  156.41,118.49 0 top
C33  1UF  [C0805K]  139.55,104.27 180 top
C34  1UF  [C0805K]  139.55,100.81 180 top
C35  1UF  [C0805K]  139.55,97.36 180 top
C36  1UF  [C0805K]  139.55,93.9 180 top
C38  0.1uF  [C0805K]  115.75,69.16 180 top
C39  0.1uF  [C0805K]  115.75,53.57 180 top
C40  0.1uF  [C0805K]  115.75,36.7 180 top
C41  0.1uF  [C0805K]  115.75,21.26 180 top
C42  0.01uF  [C0805]  59.76,109.74 270 bottom
C43  0.022uF  [C0805]  57.08,106.74 270 bottom
C44  10uF  [C0805]  54.62,106.84 270 bottom
C45  0.047uF  [C0805]  48.8,100.8 270 bottom
C46  0.047uF  [C0805]  45.88,98.97 270 bottom
C47  0.022uF  [C0805]  36.31,106.69 270 bottom
C48  10uF  [C0805]  32.6,113.07 90 bottom
C49  0.01uF  [C0805]  58.19,88.16 270 bottom
C50  0.022uF  [C0805]  32.12,86.73 270 bottom
C51  0.0047uF  [C0805]  25.69,90.36 90 bottom
D1  1N4148  [SOD123]  52.83,48.41 270 top
D2  1N4148  [SOD123]  110.08,147.62 90 top
D3  1N4148  [SOD123]  101.17,6.1 180 top
GPIO_A  [ML40]  108.22,106.22 270 top
GPIO_B  [ML14]  130.18,90.17 270 top
H1  MOUNT-PAD-ROUND3.6  [3,6-PAD]  6.35,159.84 0 top
H2  MOUNT-PAD-ROUND3.6  [3,6-PAD]  163.83,136.98 0 top
H3  MOUNT-PAD-ROUND3.6  [3,6-PAD]  6.35,4.9 0 top
H4  MOUNT-PAD-ROUND3.6  [3,6-PAD]  163.83,4.9 0 top
H5  MOUNT-PAD-ROUND3.6  [3,6-PAD]  63.98,146.73 0 top
H6  MOUNT-PAD-ROUND3.6  [3,6-PAD]  66.55,24.99 0 top
H7  MOUNT-PAD-ROUND3.6  [3,6-PAD]  119.44,79.4 0 top
HDMI  HDMI  [HDMI]  20.57,165.48 180 top
IC1  U14  [TSSOP24]  115.75,63.63 270 top
IC2  U15  [TSSOP24]  115.75,48.13 270 top
IC3  U16  [TSSOP24]  115.75,31.32 270 top
IC4  U17  [TSSOP24]  115.75,15.88 270 top
IC5  U10  [TSSOP24]  127.58,126.31 270 top
J3  AUDIO-JACK2CUI  [AUDIO-JACK-CUI-353X]  9.07,22.58 90 top
JOY1  JOYSTICK1  [M09HP]  123.01,157.73 180 top
JOY2  JOYSTICK2  [M09HP]  154.31,157.73 180 top
JP2  [JP2]  73.23,151.89 0 top
JTAG  [ML10]  8.9,91.67 270 top
L1  1uH  [L3225M]  20.57,146.05 0 top
L2  1uH  [L3225M]  20.57,140.46 0 top
L3  1uH  [L3225M]  20.57,134.24 0 top
LM339  U11  [TSSOP-14]  127.58,112.93 0 top
MAX232  U13  [SO16L]  151.08,97.05 270 top
MIC_IN_SEL  J1  [JP3Q]  43.38,21.56 0 top
P.B.I._INTERFACE  [ML40]  144.09,39.57 270 top
PF1  1A  [R1206]  5.57,149.02 0 top
PF2  500mA  [R1206]  5.46,40.51 0 top
PF3  500mA  [R1206]  49.53,48.41 90 top
PF4  500mA  [R1206]  114.3,151.33 0 top
QS3384  U9  [TSSOP24]  46.99,58.04 270 top
R1  1k  [R0805]  2.41,144.4 0 top
R2  4k7  [R0805]  2.41,138.38 0 top
R3  200  [R0805]  14.1,129.11 0 top
R4  240  [R0805]  22.28,129.18 270 top
R5  348  [M0805]  34.69,146.56 270 top
R6  75  [M0805]  43.77,146.56 90 top
R7  75  [M0805]  46.92,146.56 90 top
R8  75  [M0805]  50.05,146.56 90 top
R9  100  [R0805]  53.44,146.56 90 top
R10  100  [R0805]  56.31,146.56 90 top
R11  2k  [M0805]  18.19,124.82 180 top
R12  10k  [M0805]  26.34,124.82 180 top
R13  2k  [M0805]  18.19,119.28 0 top
R14  2K 1%  [M0805]  26.34,119.28 0 top
R15  4.7k  [M0805]  19.99,115.73 0 top
R16  4.7k  [M0805]  6.99,115.47 0 top
R17  10k  [M0805]  6.99,112.93 180 top
R18  10k  [M0805]  6.99,110.39 180 top
R19  1k-10k  [M0805]  6.99,107.85 180 top
R20  1k  [M0805]  6.99,105.31 180 top
R21  1k-10k  [M0805]  6.96,102.97 0 top
R22  82  [R0805]  6.86,75.34 0 top
R23  56  [R0805]  6.86,69.24 0 top
R24  56  [R0805]  6.86,63.14 180 top
R25  22  [R0805]  7.69,48.01 270 top
R25A  560  [M0805]  4.95,48.01 270 top
R26  15k  [R0805]  11.65,48.01 90 top
R27  22  [R0805]  15.71,48.01 270 top
R28  15k  [R0805]  19.83,48.01 90 top
R29  22  [R0805]  23.59,48.01 270 top
R30  15k  [R0805]  27.75,48.01 90 top
R31  22  [R0805]  31.66,48.01 270 top
R32  15k  [R0805]  35.4,48.01 90 top
R33  2k7  [M0805]  38.71,48.01 90 top
R34  2k7  [M0805]  41.86,48.01 270 top
R35  560  [M0805]  53.04,39.57 0 top
R36  560  [M0805]  64.87,39.57 0 top
R37  560  [M0805]  53.04,32.16 0 top
R38  560  [M0805]  64.87,32.16 0 top
R39  1k  [M0805]  61.9,36.02 90 top
R40  47K  [M0805]  90.42,134.87 270 top
R41  47K  [M0805]  93.98,134.9 270 top
R42  47K  [M0805]  97.41,134.9 270 top
R43  4.7k  [M0805]  128.68,152.25 90 top
R44  4.7k  [M0805]  159.84,152.25 90 top
R45  1.2K  [R0805]  156.41,114.6 0 top
R46  2.1K  [R0805]  156.41,110.72 180 top
R47  330  [M0805]  161.04,101.35 180 top
R48  330  [M0805]  165.99,101.35 180 top
R49  330  [M0805]  165.99,98.09 180 top
R50  10k  [M0805]  153.16,33.32 180 top
R51  10k  [M0805]  153.16,30.07 180 top
R52  4k7  [M0805]  153.16,26.82 180 top
R53  4k7  [M0805]  153.16,23.57 180 top
R54  4k7  [M0805]  153.16,19.76 180 top
R55  4k7  [M0805]  153.16,15.95 180 top
RESET  RESET  [JP1]  5.77,29.97 90 top
RESET_LED  RESET  [JP1]  6.02,35.43 270 top
RN1  270  [743-8]  16.48,155.88 0 top
RN2  270  [743-8]  23.3,155.88 0 top
RN3  100  [743-8]  38.51,62.41 270 top
RN4  100  [743-8]  38.46,54.99 270 top
RN5  4K7  [743-8]  66.4,61.65 90 top
RN6  4K7  [743-8]  66.4,53.49 90 top
RN7  4K7  [743-8]  116.33,139.27 270 top
RN8  220  [743-8]  124.56,139.27 0 top
RN9  220  [743-8]  133.1,139.27 0 top
RN10  4K7  [743-8]  140.34,139.27 270 top
RN11  1K  [743-8]  149.02,139.27 0 top
RN12  4K7  [743-8]  138.4,123.88 270 top
RN13  100  [743-8]  101.24,127.32 270 top
RN14  100  [743-8]  101.24,121.43 270 top
RN15  100  [743-8]  101.24,115.54 270 top
RN16  100  [743-8]  101.24,109.64 270 top
RN17  100  [743-8]  101.24,103.75 270 top
RN18  100  [743-8]  101.24,97.76 270 top
RN19  100  [743-8]  101.24,91.76 270 top
RN20  100  [743-8]  101.24,85.77 270 top
RN21  100  [743-8]  101.24,79.67 270 top
RN22  100  [743-8]  119.44,127.32 270 top
RN23  100  [743-8]  119.44,121.43 270 top
RN24  100  [743-8]  119.44,115.54 270 top
RN25  100  [743-8]  119.44,109.64 270 top
RN26  100  [743-8]  119.44,103.75 270 top
RN27  100  [743-8]  119.44,97.76 270 top
RN28  100  [743-8]  119.44,91.76 270 top
RN29  100  [743-8]  101.17,67.89 270 top
RN30  100  [743-8]  101.17,60.89 270 top
RN31  100  [743-8]  101.17,53.89 270 top
RN32  100  [743-8]  101.17,46.89 270 top
RN33  100  [743-8]  101.17,39.89 270 top
RN34  100  [743-8]  101.17,32.89 270 top
RN35  100  [743-8]  101.17,25.89 270 top
RN36  100  [743-8]  101.17,18.89 270 top
RN37  100  [743-8]  101.17,11.89 270 top
RX  [CHIP-LED0805]  165.86,104.27 270 top
S-VIDEO_COMP  [MDIN04SS]  69.47,169.53 180 top
S.I.O._INTERFACE  [ML10]  58.62,56.54 270 top
SD  [SDSOCKET]  78.41,141.33 0 top
SDRAM  U8  [TSOP54]  18.73,69.49 270 top
SPI  U6  [EPCS_BOTH]  16.43,108.23 0 top
TR1  BC817-16LT1SMD  [SOT23-BEC]  6.86,59.33 0 top
TR2  MOT  [SOT23-BEC]  45.62,48.01 0 top
TX  [CHIP-LED0805]  161.04,104.27 270 top
U$1  U7  [CYCLONEVF484V2]  46.41,99.39 0 top
U$5  HDR_SMALL_36_DEV_LALIGNED  [HDR_141_36]  97.38,101.41 270 top
U$6  MOLEX_PS  [MOLEX_PS]  3.61,167.03 0 top
USB_A_B  [ML10]  15.49,35.69 270 top
VGA  DB15  [DB15]  45.34,161.59 0 top
VIDEODACSA  U5  [QFP50P900X900X120-49N]  38.01,126.57 90 top
X1  [USB-A-H]  18.9,9.86 90 top
X2  [F09V]  152.63,80.7 0 top
X3  [USB-A-H]  36.07,9.86 90 top
XTL_50MHZ  50MHz  [SG-636]  69.75,137.46 0 top

## Tracks (layer width: path | path; a pad name or v marks a point on that pad's centre or on a via)
1V1  (via drill 0.25, 0.25 pad 0.46, 0.6)
  Top 0.2: 35.41,97.39 32.41,94.39 v27.58,94.39 | 35.41,101.39 32.91,103.89 v28.61,103.89
  Top 0.203: U$1.K15 U$1.J16
  Top 0.25: U$1.P13 v47.41,96.39 | U$1.N4 v38.41,98.39 | U$1.K13 U$1.L14 U$1.M15 v50.41,98.39 | v38.41,102.39 U$1.J4 U$1.K5 | U$1.K11 U$1.J12 v47.41,102.39 | U$1.P3 37.41,97.39 35.41,97.39 | U$1.N10 v44.41,98.39 | v45.41,96.39 U$1.P11 U$1.N12 | 35.41,101.39 37.41,101.39 U$1.K3 U$1.L4 | v50.41,96.39 U$1.P15 U$1.N14 U$1.M13 U$1.L12 | U$1.J14 U$1.K15 U$1.L16 v51.41,99.39 | U$1.J16 v51.41,101.39 | U$1.J10 v45.41,102.39 | v44.41,100.39 U$1.L10 U$1.M11
  Top 0.305: U$1.K11 U$1.L10 | U$1.J10 44.91,101.85 44.37,101.32 44.41,101.29 v44.41,100.39 44.37,100.36 | U$1.J14 U$1.K13 U$1.L12 U$1.M11 U$1.N10 | U$1.N14 U$1.P13 | U$1.P11 U$1.M13 | TR1.B 5.91,56.7 v6.5,56.11
  Top 0.508: C8.1 25.84,135.25 24.89,135.25 23.88,134.24 L3.2 21.97,133.73 24.38,131.32 24.38,128.52 24,128.14 | 24,128.14 22.86,128.14 | 22.86,128.14 22.37,128.14 R4.2 | C9.1 22.2,128.16 R4.2 | R4.2 22.77,128.23 22.86,128.14 | 24,128.14 27.81,128.14 v28.19,127.76
  Route2 0.203: v27.68,97.39 26.93,97.39 | 42.95,102.03 43.16,101.88 44.12,101.88 | v27.58,94.39 25.25,94.39 23.55,92.69
  Route2 0.229: 42.95,102.03 42.9,102.89 44.02,102.89
  Route2 0.254: 38.96,102.89 41.73,102.89 | 3.3/2.5/1.1/GND.3 70.51,123.27 70.87,123.62
  Route2 0.305: 34.11,111.78 42.67,103.17 | 42.67,103.17 42.9,103 42.9,102.89 | 44.58,102.44 44.63,102.44 | 44.63,102.44 45.36,102.44 v45.41,102.39 | 38.96,102.89 v38.41,102.39 | 26.93,97.39 26.29,96.75 | 26.29,103.76 28.48,103.76 v28.61,103.89 | 26.9,107.01 26.29,107.62 | 41.73,102.89 41.94,103.1 42.6,103.1 42.67,103.17 | 44.12,101.88 44.63,102.44 | 44.02,102.89 44.58,102.34
  Route2 0.508: v28.19,127.76 28.19,126.49 27.96,126.26
  Route2 0.61: 31.06,113.82 32.08,113.82 34.11,111.78 | 31.06,113.82 26.19,113.82 26.29,107.62 26.29,103.76 26.29,96.75 26.29,96.39 23.55,93.65 23.55,92.69 23.55,76.17 26.09,73.64 v38.68,73.64 72.97,73.64 75.16,75.82 75.16,121.94 73.48,123.62 70.87,123.62 47.62,123.62 46.05,122.05 42.44,122.05 42.24,121.84 40.87,121.84 39.75,122.96 31.27,122.96 27.96,126.26 | v30.86,114.53 30.86,114.02 31.06,113.82
  Bottom 0.2: 35.41,98.39 34.41,97.39 v27.68,97.39 | 35.41,102.39 30.91,106.89 v26.98,106.89
  Bottom 0.25: v38.41,98.39 35.41,98.39 | v38.41,102.39 35.41,102.39
  Bottom 0.305: C45.2 48.95,99.85 v50.41,98.39 | C46.2 45.88,97.55 45.29,96.95 45.29,96.51 v45.41,96.39 | v6.5,56.11 21.84,56.11 38.68,72.95 v38.68,73.64
  Bottom 0.61: v30.86,114.53 31.37,114.02 C48.2
  pour Route2 (isolate 0.254): 44.12,102.23 50.42,102.23 50.42,96.19 43.66,96.19 43.66,102.18
2V5  (via drill 0.25, 0.25 pad 0.46, 0.5, 0.6)
  Top 0.2: 35.41,95.39 29.91,89.89 v28.61,89.89 | 57.41,102.39 66.16,111.14 67.81,111.14 | 35.41,99.39 v29.92,99.39 | 53.41,110.39 62.16,119.14 v62.16,120.69 | 37.91,110.39 30.16,118.14
  Top 0.203: U$1.A3 v37.41,109.4 | 67.81,111.14 69.89,111.14 v71.65,112.9 | U$1.W18 52.93,91.89 53.42,92.38 v53.42,93.38 v53.41,93.39 | 30.16,118.14 v30.16,120.69
  Top 0.25: U$1.T3 37.41,95.39 35.41,95.39 | U$1.U18 v53.41,93.39 | U$1.H19 54.41,102.39 57.41,102.39 | U$1.M3 37.41,99.39 35.41,99.39 | U$1.F4 v38.41,105.39 | U$1.T5 v39.41,95.39 | U$1.W18 v52.41,91.39 | U$1.D18 53.41,107.39 53.41,110.39 | U$1.D11 v46.41,107.39 | U$1.W13 v47.41,91.39 | U$1.E6 v41.41,106.39 | U$1.W7 v41.41,91.39 | U$1.A3 37.91,110.39
  Top 0.305: 37.41,95.39 v39.41,95.39 | R23.2 8.94,69.24 v9.35,68.83
  Top 0.508: 2.5V.4 16.61,138.18 21.46,138.18 21.97,138.69 L2.2 23.5,140.46 24.51,141.48 25.71,141.48 C7.1
  Top 0.61: C7.1 27.75,141.41 v27.94,141.22 | C18.2 25.32,111.18 25.91,111.76 25.91,114.96 v25.98,115.04
  Route15 0.203: v29.92,99.39 24.41,99.39 | v37.41,109.4 37.41,108.38 37.59,108.2 | v62.16,120.69 62.16,120.68 62.15,120.67 62.15,121.34 61.54,121.94 | v46.41,107.39 46.28,107.39 | 23.19,92.63 25.93,89.89 v28.61,89.89 | v41.41,91.39 41.35,91.39 40.87,91.87 39.9,91.87 38.89,92.89 38.89,94.87 v39.41,95.39 | v47.41,91.39 47.29,91.39 46.86,91.82 46.86,98.88 46.89,98.91 | 52.43,91.39 v52.41,91.39 52.41,91.46 | 53.37,93.35 v53.41,93.39 | v71.65,112.9 71.65,118.14 71.5,118.29
  Route15 0.254: 3.3/2.5/1.1/GND.2 67.97,120.52 68.14,120.7
  Route15 0.305: v38.41,105.39 38.41,107.39 38.05,107.75 | v41.41,106.39 39.49,106.39 39.45,106.35 | 24.41,99.39 23.19,100.61 | 46.89,98.91 52.3,93.5 53.3,93.5 v53.41,93.39
  Route15 0.61: v25.98,115.04 28.73,115.04 30.4,113.36 32.44,113.36 37.59,108.2 38.05,107.75 39.45,106.35 v43.41,102.39 46.89,98.91 | v25.98,115.04 24.56,115.04 23.19,113.67 23.19,100.61 23.19,92.63 23.19,82.58 26.9,78.87 26.9,71.96 v29.46,69.39 29.54,69.32 68,69.32 74.65,75.97 74.65,115.14 71.5,118.29 69.47,118.29 68.25,119.51 68.25,120.59 68.14,120.7 66.89,121.94 61.54,121.94 41.53,121.94 40.36,123.11 31.57,123.11 29.34,125.35 29.34,128.27 28.07,129.54 28.07,140.59 | v25.98,115.04 25.88,115.04 | 28.07,140.59 28.07,141.1 v27.94,141.22 27.94,140.72 28.07,140.59
  Bottom 0.203: v43.41,102.39 44.88,100.91 45.9,100.91 46.91,101.88 46.91,106.86 46.41,107.37 v46.41,107.39
  Bottom 0.305: v9.35,68.83 28.91,68.83 v29.46,69.39
  Bottom 0.61: C51.2 27.18,91.31 v28.61,89.89 | C47.2 38.06,105.74 v38.41,105.39
3V3  (via drill 0.25, 0.25 pad 0.46, 0.38, 0.51, 0.6)
  Top 0.2: 35.41,105.39 29.91,110.89 v28.61,110.89 | 55.41,88.39 65.16,78.64 v65.16,76.59 | 57.41,104.39 67.16,114.14 v67.81,114.14 | 57.41,107.89 65.16,115.64 v68.41,115.64 | 35.41,95.89 30.91,91.39 v29.21,91.39 | 57.41,105.39 66.66,114.64 v68.41,114.64 | 50.91,110.39 59.16,118.64 v59.16,120.69 | 35.41,101.89 31.41,105.89 v28.61,105.89 | 40.91,110.39 32.66,118.64 v32.66,120.09 | 54.41,110.39 62.66,118.64 v62.66,120.09 | 35.41,105.89 29.91,111.39 v29.21,111.39 | 57.41,96.39 57.66,96.64 v68.41,96.64 | 50.91,88.39 57.66,81.64 v57.66,77.19 | 43.41,110.39 37.66,116.14 v37.66,117.73 | 35.41,91.89 30.41,86.89 v28.61,86.89
  Top 0.203: U$1.W11 U$1.W12 | R21.2 8.27,102.44
  Top 0.25: U$1.L6 v40.41,100.39 | U$1.J6 v40.41,102.39 | U$1.F3 37.41,105.39 35.41,105.39 | U$1.AA21 55.41,89.39 55.41,88.39 | U$1.F21 56.41,104.39 57.41,104.39 | U$1.R18 U$1.R19 U$1.R20 v55.41,95.39 | U$1.G7 U$1.F8 U$1.E8 U$1.D8 v43.41,107.39 | U$1.P20 U$1.P21 56.41,96.39 57.41,96.39 | v44.41,91.39 U$1.W10 U$1.W11 | U$1.W15 U$1.W14 U$1.Y13 U$1.Y12 | U$1.T6 v40.41,95.39 | U$1.R8 v42.41,96.39 | U$1.Y8 U$1.Y7 v41.41,90.39 | U$1.C22 57.41,107.89 | U$1.C7 U$1.B8 43.41,109.39 43.41,110.39 | U$1.M19 v54.41,98.39 | U$1.W20 v55.41,91.39 | U$1.AA16 U$1.AB16 50.91,88.39 | U$1.C12 v47.41,108.39 | U$1.U14 v48.41,93.39 | U$1.F11 U$1.E11 v46.41,106.39 | U$1.K18 v53.41,100.39 | U$1.G14 v49.41,104.39 | 35.41,95.89 U$1.R1 U$1.R2 | U$1.D4 v39.41,107.39 | U$1.E18 53.41,105.39 57.41,105.39 | U$1.A16 50.91,110.39 | 35.41,101.89 U$1.J1 U$1.J2 | U$1.U19 v54.41,93.39 | U$1.A6 40.91,110.39 | U$1.D15 U$1.D16 v51.41,107.39 | U$1.B19 54.41,109.39 54.41,110.39 | U$1.H17 v52.41,102.39 | U$1.T11 v45.41,94.39 | U$1.Y4 v38.41,90.39 | v53.41,97.39 U$1.N18 U$1.M17 | U$1.E1 35.41,105.89 | U$1.W6 v40.41,91.39 | U$1.V8 v42.41,92.39 | U$1.W17 v51.41,91.39 | U$1.D14 U$1.C14 v49.41,108.39 | U$1.C10 v45.41,108.39 | U$1.W12 U$1.Y12 | U$1.L20 v55.41,99.39 | U$1.W1 35.41,91.89 | U$1.Y12 v46.41,90.39
  Top 0.254: v42.09,122.96 41.94,122.96 41.33,123.57 41.33,123.72 41.43,123.83 VIDEODACSA.13 | VIDEODACSA.30 38.26,131.73 v38.53,132 38.77,131.77 VIDEODACSA.29 | VIDEODACSA.38 32.59,128.83 v32.54,128.88 | R22.2 9.5,75.34 v11.35,73.48
  Top 0.305: 8.27,102.44 8.72,102.89 v9.09,102.89
  Top 0.406: SDRAM.49 25.75,75.89 v25.78,75.92 | SDRAM.3 14.37,78.29 v14.55,78.11 | v11.36,73.49 v11.35,73.48 SDRAM.9 | v11.66,59.11 11.68,59.09 SDRAM.27 14.04,59.09 C19.1 | XTL_50MHZ.P$4 XTL_50MHZ.P$1 | SDRAM.43 25.48,71.09 v25.53,71.04 | 10.74,69.88 11.1,69.52 v11.35,69.52 11.39,69.49 SDRAM.14 | v13.74,80.9 14.05,80.59 14.05,79.88 SDRAM.1 | SPI.L$2 19.57,110.81 SPI.8 | 6.04,120.95 6.04,119.89 6.63,119.3 | 6.63,119.3 7.81,119.3 C16.1 | ADC.1 8.13,123.04 6.04,120.95 | 6.04,120.95 5.61,120.95 v5.33,121.23 | R12.2 25.29,124.71 v20.7,124.71 | 4.57,115.47 4.52,115.47 4.52,112.93 | 4.52,112.93 4.52,110.39 | 4.52,110.39 4.52,107.82 6.04,107.82 R19.2 | R18.2 4.52,110.39 | R17.2 4.52,112.93 | R16.1 4.57,115.47 | 4.57,115.47 4.57,117.25 6.63,119.3 | R42.2 R41.2 90.45,133.95 R40.2 88.94,133.92 v88.7,134.16 | SD.4 93.76,139.13 v94.11,138.79 | RN12.8 RN12.7 RN12.6 RN12.5 139.36,125.64 139.47,125.75 v141.15,125.75 | R45.2 158.95,114.61 v159.13,114.43 | RX.A 163.88,104.27 163.53,104.62 163.53,105.66 v163.35,105.84 | TX.A 159.03,104.27 158.72,104.57 158.72,105.46 v158.52,105.79 | MAX232.16 157.96,101.5 v158.24,101.22
  Top 0.508: 19.56,112.45 SPI.L$2 19.58,112.43 19.58,114.28 19.05,114.81 R15.1 | C17.1 R15.1 | R11.1 20.6,124.82 v20.7,124.71 | R13.2 20.42,119.28 v20.57,119.13 20.57,118.11 19.04,116.58 R15.1 | C15.1 C14.1 C13.1 C12.1 40.45,132.86 v40.01,132.41 | C11.1 40.68,148.45 v40.66,150.04 | 3.3V.4 16.31,145.11 17.6,143.81
  Top 0.61: 11.3,73.43 10.44,72.57 10.44,70.18 10.74,69.88 10.74,59.92 11.66,59 | 17.6,143.81 21.16,143.81 21.97,144.63 L1.2 | XTL_50MHZ.P$1 65.85,132.43 v64.81,131.39 63.34,132.86 C27.1
  Top 0.813: L1.2 22.53,146.61 23.44,146.61 23.84,147 C6.1 26.41,147.62 v27.64,147.62
  Route2 0.203: 27.1,102.44 29.06,102.39 v29.21,102.39 | 47.93,93.87 47.93,94.74
  Route2 0.254: v48.41,93.39 47.93,93.87 | v32.54,128.88 32.51,128.88 32.46,128.93
  Route2 0.305: 24.66,102.23 24.26,101.83 | v9.09,102.89 9.12,102.92
  Route2 0.406: v25.78,75.92 25.78,75.72 25.98,75.51 | v13.74,80.9 13.74,81.2 13.79,81.25 | v14.55,78.11 14.55,77.75 | v11.35,73.48 10.74,73.48 | v11.66,59.11 11.56,59.11 11.25,59.41 | v25.53,71.04 25.83,70.74 25.88,70.74 | v38.53,132 38.63,132 38.84,132.21 | v42.09,122.96 42.09,122.86 41.94,122.71 | v5.33,121.23 5.33,121.26 5.23,121.36 | v94.11,138.79 94.13,138.79 94.16,138.76 | v141.15,125.75 141.22,125.75 141.25,125.78 | v159.13,114.43 159.26,114.3 | v88.7,134.16 88.7,134.21 88.65,134.26 | v163.35,105.84 163.32,105.84 163.25,105.92 | v158.52,105.79 158.52,105.61 158.44,105.69 | v158.24,101.22 158.29,101.17
  Route2 0.508: v40.66,150.04 40.64,150.01 40.64,150.04
  Route2 0.61: v33.86,88.57 33.93,88.67 | v61.09,85.22 61.19,85.06 61.04,85.24 | v11.35,69.52 11,69.52 | v64.81,131.39 64.64,131.39 64.48,131.22
  Route2 0.813: v27.64,147.62 27.69,147.57 27.76,147.57
  Route15 0.508: v20.7,124.71 20.83,124.71 | v20.57,119.13 20.7,119
  Bottom 0.2: 35.41,100.39 33.41,102.39 v29.21,102.39 | 39.41,110.39 31.16,118.64 v31.16,120.69 | 38.41,88.39 28.16,78.14 v28.16,76.59
  Bottom 0.203: 29.16,102.44 v29.21,102.39
  Bottom 0.25: v40.41,100.39 35.41,100.39 | v39.41,107.39 39.41,110.39 | v38.41,90.39 38.41,88.39
  Bottom 0.508: v40.01,132.41 38.94,132.41 v38.53,132
  Bottom 0.61: 54.1,107.59 54.1,107.79 54.2,107.69 54.23,107.72 54.89,107.72 54.82,107.79 C44.1 | C44.1 54.81,107.79 58.19,111.58 59.28,112.67 59.96,112.67 | C42.1 59.76,112.5 59.96,112.67 | 59.96,112.67 v60.33,113 | C49.1 59.68,89.11 61.34,87.45 v61.09,85.22 | C44.1 56.98,107.79 C43.1 | 32.04,87.6 C50.1 32.96,87.67 v33.86,88.57
  pour Route2 (isolate 0.152, rank 6): 0.38,169.54 169.69,169.8 169.92,0.51 0.61,0.36 0.38,169.24 0.28,169.49
4V3_INT
  Top 0.203: 119.66,21.2 arc45 119.63,21.26
  Top 0.254: IC3.24 | IC2.24 | IC1.24 | 118.69,19.43 IC4.24
  Top 0.305: IC4.24 119.27,19.45 arc45 119.45,19.52 119.66,19.74 119.66,21.2 arc45 119.63,21.26 | IC3.24 119.37,34.89 arc45 119.55,34.97 120.04,35.46 120.04,36.37 arc-45 120.11,36.55 120.27,36.7 | IC2.24 119.73,51.71 arc45 119.91,51.78 120.22,52.09 120.22,53.45 arc-45 120.27,53.57 | IC1.24 119.42,67.2 arc45 119.6,67.28 119.96,67.64 119.96,68.98 | 119.96,68.98 arc45 119.89,69.16 | 119.96,68.98 arc45 120.09,69.03 120.22,69.16
  Top 0.61: C39.1 120.27,53.57 122.91,53.57 arc-45 123.13,53.48 123.77,52.83 | C40.1 120.27,36.7 122.96,36.7 arc-45 123.18,36.61 123.77,36.02 | C41.1 119.63,21.26 123.21,21.26 arc-45 123.44,21.17 123.77,20.83 | D3.1 120.04,6.1 arc45 120.26,6.19 123.77,9.7 123.77,20.83 | 123.77,20.83 123.77,36.02 | 123.77,36.02 123.77,52.83 | 123.77,52.83 123.77,67.51 arc45 123.68,67.73 122.34,69.07 arc45 122.12,69.16 120.22,69.16 C38.1
4V3_INT1
  Top 0.305: C28.2 129.54,132.59 130.5,131.63 IC5.24
  Top 0.406: C28.2 127,132.22 127,131.62 126.34,130.96 117.75,130.96 108.58,140.13 108.58,143.59 110.21,145.21 110.21,145.8 D2.1
5V0  (via drill 0.25, 0.51, 0.6)
  Top 0.203: HDMI.18 24.32,159.65 24.51,159.46 25.22,159.46 25.45,159.23 25.45,158.5 v25.58,158.37
  Top 0.254: LM339.3 123.58,113.53 v123.44,113.67 | 141.22,137.3 RN10.5
  Top 0.406: RN5.4 69.47,63.55 | 69.47,51.59 RN6.1 69.42,51.59 | RN5.3 69.47,62.28 | RN5.2 69.47,61.01 | RN5.1 69.47,59.74 | RN6.2 69.47,52.86 | RN6.3 69.47,54.13 | RN6.4 69.47,55.4 | R55.1 154.15,15.99 154.15,19.72 R54.1 R53.1 R52.1 | 168.78,105.79 169.04,106.05 | RN7.4 RN7.3 | RN7.3 RN7.2 RN7.1 | RN7.3 115.38,141.03 115.27,141.15 | D2.2 110.08,150.98 v110.01,151.05 | RN10.5 RN10.6 RN10.7 RN10.8 | 141.29,141.41 141.3,141.43 | R44.2 161.86,153.2 162.67,154.01 | R43.2 128.68,154.36 v128.47,154.56 | v148.46,118.11 148.44,118.08 74HCT03.14 | R25A.1 4.95,49.66 4.19,50.42 2.16,50.42 1.52,51.05 | 3.17,40.64 4.04,40.64 PF2.1 | v141.1,130.18 143.12,130.18 C29A.1 C30A.1 143.13,126.25 v143.13,124.08 | 1V1.A 2.16,66.19 1.52,66.83
  Top 0.508: C5.1 12.92,135.19 1.1V.1 | 3.3V.1 10.59,146.99 10.41,146.69 | 10.41,146.69 9.04,146.69 C3.1 9.02,148.08 8.08,149.02 7.49,149.02 PF1.2 | C4.1 9.03,141.24 10.41,142.62 10.92,142.62 | 2.5V.1 12.14,141.4 10.92,142.62 | 10.41,146.69 10.41,144.4 10.79,143.89 10.79,142.75 10.92,142.62 | 38.99,46.78 R33.1 | 52.83,45.06 52.65,44.88
  Top 0.61: 1.52,144.46 R1.1 | 1.52,138.32 R2.1 | C5.1 7.43,135.19 6.35,134.11 2.67,134.11 1.52,135.25 | 69.47,63.55 69.47,62.28 69.47,61.01 69.47,59.74 69.47,55.4 69.47,54.13 69.47,52.86 69.47,51.59 | 69.42,51.59 69.42,49.25 65.05,44.88 52.65,44.88 46.28,44.88 | 99.39,6.17 D3.2 97.99,6.1 96.01,4.12 | 96.88,4.12 151.89,4.12 154.11,6.33 R55.1 153.92,15.76 | D1.2 52.83,45.06 | 38,44.88 46.28,44.88 | R33.1 38.71,45.59 38,44.88 | TR2.E 46.57,45.17 46.28,44.88 | 38,44.88 25.81,44.88 v24.84,43.92 | v6.58,43.76 2.95,43.76 v1.52,45.19 | 115.27,141.15 110.31,141.15 v110.01,141.45 | RN10.5 141.29,141.41 | 141.3,141.43 141.3,143.08 v140.11,144.27 | v141.22,136.14 141.22,137.3
  Top 0.813: 3.17,40.64 1.52,42.29 v1.52,45.19 | GPIO_B.14 131.44,78.11 136.02,73.53 168.02,73.53 169.04,74.55 169.04,106.05 169.04,150.11 167.64,151.51 165.18,151.51 162.67,154.01 162.56,154.13 162.56,164.39 160.07,166.88 116.33,166.88 114.91,165.46 114.91,161.34 v114.5,160.93
  Top 1.016: PF1.2 6.99,147.96 6.22,147.19 2.67,147.19 1.52,146.05 1.52,144.46 | R1.1 R2.1 | 1.52,138.32 1.52,135.25 1.52,66.83 1.52,51.05 v1.52,45.19 | 7.49,149.02 8.08,149.61 8.08,154.03 v12.42,158.37 v13.36,158.37 | 96.88,4.12 96.01,4.12 94.06,2.16 v90.4,2.16 | PF4.1 112.65,151.56 110.01,151.56 v110.01,151.05
  Route2 0.61: v106.91,135.66 106.91,132.61 108.23,131.27 108.2,118.95 GPIO_A.11
  Bottom 0.406: v128.47,154.56 115.47,154.56 114.12,155.91 | 110.01,151.79 110.16,151.79 v110.16,151.99 | v123.44,113.67 124.59,113.67 v141.1,130.18 | v143.13,124.08 148.46,118.75 v148.46,118.11
  Bottom 0.61: v25.58,158.37 25.96,158.37 | v140.11,144.27 110.97,144.27 110.01,143.31 | v24.84,43.92 6.73,43.92 v6.58,43.76 | v141.22,136.14 141.1,136.02 v141.1,130.18
  Bottom 0.813: v114.5,160.93 114.5,160.81 114.63,160.68 | v1.5,43.92 1.5,45.16 v1.52,45.19
  Bottom 1.016: v12.42,158.37 v13.36,158.37 v25.58,158.37 | 25.96,158.37 28.14,158.37 38.2,168.43 107.01,168.43 v114.5,160.93 114.63,160.81 114.63,160.68 114.63,156.41 114.12,155.91 110.01,151.79 v110.01,151.05 110.01,143.31 v110.01,141.45 110.01,138.76 v106.91,135.66 | v1.52,45.19 1.52,16.89 16.26,2.16 v90.4,2.16 v91.95,2.16
5V00
  Top 0.61: PF4.2 115.72,159.21 118.24,161.72 121.67,161.72 JOY1.7 128.47,163.09 154.43,163.09 155.68,161.85 JOY2.7
5V0FAST  (via drill 0.6)
  Top 0.508: R1.2 3.68,144.4 4.45,143.64 4.45,143.38 5.5,143.38 C1.1 5.56,142.65 v6.27,141.99 | 1.1V.3 11.53,133.3 11.12,132.89 v11.12,132.26
  Bottom 0.508: v6.27,141.99 7.16,141.05 7.16,138.3 8.84,136.63 10.44,136.63 11.12,135.94 v11.12,132.26
5V0SLOW  (via drill 0.6)
  Top 0.508: 5.59,137.46 C2.2 5.59,137.4 | R2.2 3.36,136.21 3.81,135.76 5.21,135.76 5.59,136.14 | 5.59,136.14 5.59,137.4 | 2.5V.3 12.14,139.52 v11.43,138.81 9.91,137.29 8,137.29 6.86,136.14 5.59,136.14 | 5.67,137.54 5.59,137.46 | 5.59,137.46 5.59,137.4 | v11.81,144.15 11.81,145.11 3.3V.3
  Bottom 0.508: v11.81,144.15 11.81,139.19 v11.43,138.81
.A0  (via drill 0.25)
  Top 0.254: IC3.2 v111.79,34.24 v111.78,34.24
  Bottom 0.254: v111.78,34.24 139.93,34.24 141.4,35.71 142.77,35.71 P.B.I._INTERFACE.23
.A1  (via drill 0.25)
  Top 0.254: IC3.6 v111.89,31.64 v111.89,31.65
  Bottom 0.254: v111.89,31.65 140.44,31.65 141.76,32.97 142.57,32.97 P.B.I._INTERFACE.25
.A2  (via drill 0.25)
  Top 0.254: IC3.10 111.85,29.04 v111.84,29.03
  Bottom 0.254: v111.84,29.03 140.26,29.03 141.83,30.61 142.75,30.61 P.B.I._INTERFACE.27
.A3  (via drill 0.25)
  Top 0.254: IC3.15 117.94,29.04 v117.32,28.42
  Bottom 0.254: v117.32,28.42 117.32,28.04 117.47,27.89 140.72,27.89 142.19,29.36 144.04,29.36 P.B.I._INTERFACE.28
.A4  (via drill 0.25)
  Top 0.254: IC3.9 v111.84,29.69
  Bottom 0.254: v111.84,29.69 139.5,29.69 141.66,31.85 143.99,31.85 P.B.I._INTERFACE.26
.A5  (via drill 0.25)
  Top 0.254: IC3.5 111.9,32.29 v111.89,32.31
  Bottom 0.254: v111.89,32.31 139.95,32.31 142.14,34.49 144.09,34.49 P.B.I._INTERFACE.24
.A6  (via drill 0.25)
  Top 0.254: IC2.23 117.76,51.06 114.07,47.37 v114.07,45.24
  Bottom 0.254: v114.07,45.24 114.07,43.94 115.19,42.82 135.41,42.82 141.28,37.01 143.87,37.01 P.B.I._INTERFACE.22
.A7  (via drill 0.25)
  Top 0.254: IC2.19 117.9,48.46 116.15,46.71 116.15,45.82 v115.59,45.26
  Bottom 0.254: v115.59,45.26 115.62,44.91 116.66,44.02 136.53,44.02 141.1,39.55 143.97,39.55 P.B.I._INTERFACE.20
.A8  (via drill 0.25)
  Top 0.254: IC2.15 117.72,45.86 v117.09,45.24
  Bottom 0.254: v117.09,45.24 137.26,45.24 140.74,42.11 143.84,42.11 P.B.I._INTERFACE.18
.A9  (via drill 0.25)
  Top 0.254: IC2.9 v111.84,46.51
  Bottom 0.254: v111.84,46.51 139.14,46.51 141.2,44.65 144.04,44.65 P.B.I._INTERFACE.16
.A10  (via drill 0.25)
  Top 0.254: IC1.10 111.85,61.35 v111.84,61.37
  Bottom 0.254: v111.84,61.37 137.95,61.37 140.59,58.73 142.72,58.73 P.B.I._INTERFACE.5
.A11  (via drill 0.25)
  Top 0.254: IC1.15 117.54,61.35 v117.09,60.86
  Bottom 0.254: P.B.I._INTERFACE.6 144.12,57.33 140.84,57.33 137.31,60.86 v117.09,60.86
.A12  (via drill 0.25)
  Top 0.254: IC2.5 111.85,49.11 v111.84,49.12
  Bottom 0.254: v111.84,49.12 139.9,49.12 141.91,47.19 143.97,47.19 P.B.I._INTERFACE.14
.A13  (via drill 0.25)
  Top 0.254: IC3.23 116.18,34.24 114.63,32.69 114.63,28.98 v114.17,28.37
  Bottom 0.254: v114.17,28.37 114.17,26.75 115.11,25.81 137.47,25.81 141.55,21.72 144.02,21.72 P.B.I._INTERFACE.34
.A14  (via drill 0.25)
  Top 0.254: IC4.2 v111.71,18.8
  Bottom 0.254: P.B.I._INTERFACE.35 142.72,20.62 140.39,20.62 137.95,18.19 112.22,18.19 111.71,18.69 v111.71,18.8
.A15  (via drill 0.25)
  Top 0.254: IC4.5 111.7,16.85 v111.68,16.87
  Bottom 0.254: v111.68,16.87 138.1,16.87 140.28,19.33 143.89,19.33 P.B.I._INTERFACE.36
.CCTL_N  (via drill 0.25)
  Top 0.254: IC1.2 v111.89,66.55
  Bottom 0.254: v111.89,66.55 139.98,66.55 P.B.I._INTERFACE.1
.D0  (via drill 0.25)
  Top 0.254: IC2.2 111.86,51.06 v111.84,51.08
  Bottom 0.254: v111.84,51.08 140.21,51.08 P.B.I._INTERFACE.13
.D1  (via drill 0.25)
  Top 0.254: IC2.6 v111.82,48.46 v111.81,48.46
  Bottom 0.254: v111.81,48.46 138.46,48.46 141.02,45.9 142.8,45.9 P.B.I._INTERFACE.15
.D2  (via drill 0.25)
  Top 0.254: IC2.10 111.85,45.86 v111.84,45.87
  Bottom 0.254: v111.84,45.87 138.1,45.87 140.56,43.41 142.8,43.41 P.B.I._INTERFACE.17
.D3  (via drill 0.25)
  Top 0.254: IC1.23 117.48,66.55 113.94,63.02 113.94,60.91 v113.87,60.83
  Bottom 0.254: v113.87,60.83 113.84,59.33 115.01,58.17 135.23,58.17 141.28,52.25 143.79,52.25 P.B.I._INTERFACE.10
.D4  (via drill 0.25)
  Top 0.254: IC2.20 117.74,49.11 114.88,46.25 114.88,45.29 v114.86,45.26
  Bottom 0.254: v114.86,45.26 114.86,44.12 115.47,43.51 135.81,43.51 140.87,38.46 142.67,38.46 P.B.I._INTERFACE.21
.D5  (via drill 0.25)
  Top 0.254: IC2.16 117.58,46.51 v116.31,45.24
  Bottom 0.254: v116.31,45.24 116.31,45.03 116.76,44.58 137.03,44.58 140.74,40.87 142.8,40.87 P.B.I._INTERFACE.19
.D6  (via drill 0.25)
  Top 0.254: IC1.20 117.99,64.6 114.61,61.21 v114.61,60.83
  Bottom 0.254: v114.61,60.83 114.63,59.84 115.42,58.88 135.64,58.88 141,53.52 142.8,53.52 P.B.I._INTERFACE.9
.D7  (via drill 0.25)
  Top 0.254: IC1.19 118.08,63.95 115.32,61.19 v115.32,60.86
  Bottom 0.254: v115.32,60.86 116.43,59.61 136.32,59.61 141.17,54.76 144.04,54.76 P.B.I._INTERFACE.8
.EXTSEL_N  (via drill 0.25)
  Top 0.254: IC3.20 116.29,32.29 115.24,31.24 115.24,28.78 v115.01,28.42 | P.B.I._INTERFACE.33 143.43,23.06 144.7,24.33 148.77,24.33 151.26,26.82 R52.2
  Bottom 0.254: v115.01,28.42 115.01,26.98 115.67,26.31 138.2,26.31 141.5,23.01 142.77,23.01 P.B.I._INTERFACE.33
.IRQ_N  (via drill 0.25)
  Top 0.254: IC4.10 111.7,13.6 v111.68,13.61 | P.B.I._INTERFACE.39 143.53,15.44 144.78,16.69 149.88,16.69 150.62,15.95 R55.2 152.19,15.98
  Bottom 0.254: v111.68,13.61 139.98,13.61 141.73,15.37 142.75,15.37 P.B.I._INTERFACE.39
.MPD_N  (via drill 0.25)
  Top 0.254: IC4.6 v111.71,16.2 | P.B.I._INTERFACE.37 143.66,17.98 144.81,19.13 146.89,19.13 151.23,23.47 152.11,23.47 R53.2
  Bottom 0.254: v111.71,16.2 139.12,16.2 140.82,17.91 142.75,17.91 P.B.I._INTERFACE.37
.PHI2  (via drill 0.25)
  Top 0.254: IC1.5 111.85,64.6 v111.84,64.62
  Bottom 0.254: v111.84,64.62 139.22,64.62 141.4,62.43 144.09,62.43 P.B.I._INTERFACE.2
.RD4  (via drill 0.25)
  Top 0.254: IC3.16 117.75,29.69 116.61,28.55 v116.61,28.4 | P.B.I._INTERFACE.31 144.09,26.87 147.24,26.87 150.44,30.07 R51.2
  Bottom 0.254: v116.61,28.4 116.64,27.96 117.25,27.36 141.07,27.36 P.B.I._INTERFACE.31
.RD5  (via drill 0.25)
  Top 0.254: IC1.6 111.79,63.95 v111.86,63.96
  Top 0.406: P.B.I._INTERFACE.3 143.36,61.16 144.63,62.43 147.09,62.43 147.34,62.18 147.34,34.42 148.26,33.5 152.03,33.5 R50.2
  Bottom 0.254: v111.86,63.96 138.53,63.96 141.35,61.14 142.8,61.14 P.B.I._INTERFACE.3
.REF_N  (via drill 0.25)
  Top 0.254: IC4.9 111.73,14.25 v111.71,14.28 | P.B.I._INTERFACE.38 148.21,17.98 149.99,19.76 R54.2
  Bottom 0.254: v111.71,14.28 138.79,14.28 141.22,16.71 144.09,16.71 P.B.I._INTERFACE.38
.RST_N  (via drill 0.25)
  Top 0.254: IC4.15 121.07,13.6 v121.94,12.72
  Bottom 0.254: v121.94,12.72 142.65,12.72 P.B.I._INTERFACE.40
.RW_N  (via drill 0.25)
  Top 0.254: IC1.9 111.86,62 v111.84,61.98
  Bottom 0.254: v111.84,61.98 139.4,61.98 141.71,59.87 144.07,59.87 P.B.I._INTERFACE.4
.S4_N  (via drill 0.25)
  Top 0.254: IC3.19 117.9,31.64 116.31,30.05 116.31,29.06 v115.82,28.4
  Bottom 0.254: v115.82,28.4 115.82,28.12 117.17,26.77 139.34,26.77 141.81,24.31 144.07,24.31 P.B.I._INTERFACE.32
.S5_N  (via drill 0.25)
  Top 0.254: IC1.16 117.27,62 v116.15,60.88
  Bottom 0.254: v116.15,60.88 116.15,60.6 116.43,60.33 136.68,60.33 140.92,56.08 P.B.I._INTERFACE.7
A0  (via drill 0.25 pad 0.46)
  Top 0.203: SDRAM.23 15.96,62.29 20.45,66.78 20.45,81.25 25.68,86.49 25.68,90.65 27.91,92.89 v28.6,92.89 v28.61,92.89
  Top 0.25: U$1.R6 v40.41,96.39
  Route2 0.2: 35.41,95.89 32.41,92.89 v28.61,92.89
  Route2 0.25: v40.41,96.39 39.91,95.89 35.41,95.89
A1  (via drill 0.25 pad 0.46)
  Top 0.203: SDRAM.24 15.77,61.49 20.9,66.62 20.9,81.05 26.09,86.23 26.09,90.19 27.71,91.82 28.54,91.82 v28.61,91.89
  Top 0.25: U$1.R5 v39.41,96.39
  Bottom 0.2: 35.41,95.89 31.41,91.89 v28.61,91.89
  Bottom 0.25: v39.41,96.39 38.91,95.89 35.41,95.89
A2  (via drill 0.25 pad 0.46)
  Top 0.203: SDRAM.25 15.58,60.69 21.36,66.47 21.36,80.95 26.49,86.08 26.49,89.08 27.86,90.45 29.15,90.45 v29.21,90.39
  Top 0.25: U$1.T7 v41.41,95.39
  Bottom 0.2: 35.41,94.89 30.91,90.39 v29.21,90.39
  Bottom 0.25: v41.41,95.39 40.91,94.89 35.41,94.89
A3  (via drill 0.25 pad 0.46)
  Top 0.203: v28.61,88.89 28.12,88.89 26.9,87.67 26.9,85.93 21.77,80.8 21.77,66.27 15.37,59.87 13.3,59.87 SDRAM.26
  Top 0.25: U$1.U6 v40.41,94.39
  Bottom 0.2: 35.41,94.39 29.91,88.89 v28.61,88.89
  Bottom 0.25: v40.41,94.39 35.41,94.39
A4  (via drill 0.25 pad 0.46)
  Top 0.203: SDRAM.29 27.43,59.89 40.16,72.62 v40.16,76.59
  Top 0.25: U$1.Y10 v44.41,90.39
  Bottom 0.2: 44.41,88.39 40.16,84.14 v40.16,76.59
  Bottom 0.25: v44.41,90.39 44.41,88.39
A5  (via drill 0.25 pad 0.46)
  Top 0.203: SDRAM.30 27.57,60.69 39.66,72.78 v39.66,77.19
  Top 0.25: U$1.U10 v44.41,93.39
  Route2 0.2: 44.91,88.39 39.66,83.14 v39.66,77.19
  Route2 0.25: v44.41,93.39 44.91,92.89 44.91,88.39
A6  (via drill 0.25 pad 0.46)
  Top 0.203: SDRAM.31 27.81,61.49 39.29,72.97 39.29,76.45 v39.16,76.59
  Top 0.25: U$1.T10 v44.41,94.39
  Route15 0.2: 44.91,88.39 39.16,82.64 v39.16,76.59
  Route15 0.25: v44.41,94.39 44.91,93.89 44.91,88.39
A7
  Top 0.2: 43.41,88.39 38.16,83.14 38.16,76.59
  Top 0.203: SDRAM.32 27.54,62.29 38.16,72.9 38.16,76.59
  Top 0.25: U$1.AA9 43.41,89.39 43.41,88.39
A8  (via drill 0.25 pad 0.46)
  Top 0.203: SDRAM.33 27.83,63.09 37.66,72.91 v37.66,77.19
  Top 0.25: U$1.W9 v43.41,91.39
  Bottom 0.2: 43.91,88.39 37.66,82.14 v37.66,77.19
  Bottom 0.25: v43.41,91.39 43.91,90.89 43.91,88.39
A9  (via drill 0.25 pad 0.46)
  Top 0.203: SDRAM.34 28.12,63.89 37.16,72.92 v37.16,76.59
  Top 0.25: U$1.Y9 v43.41,90.39
  Bottom 0.2: 43.41,88.39 37.16,82.14 v37.16,76.59
  Bottom 0.25: v43.41,90.39 43.41,88.39
A10  (via drill 0.25 pad 0.46)